# EAGLE design falownik_project (EAGLE 9.6.2)

## Sheet 1 of 5
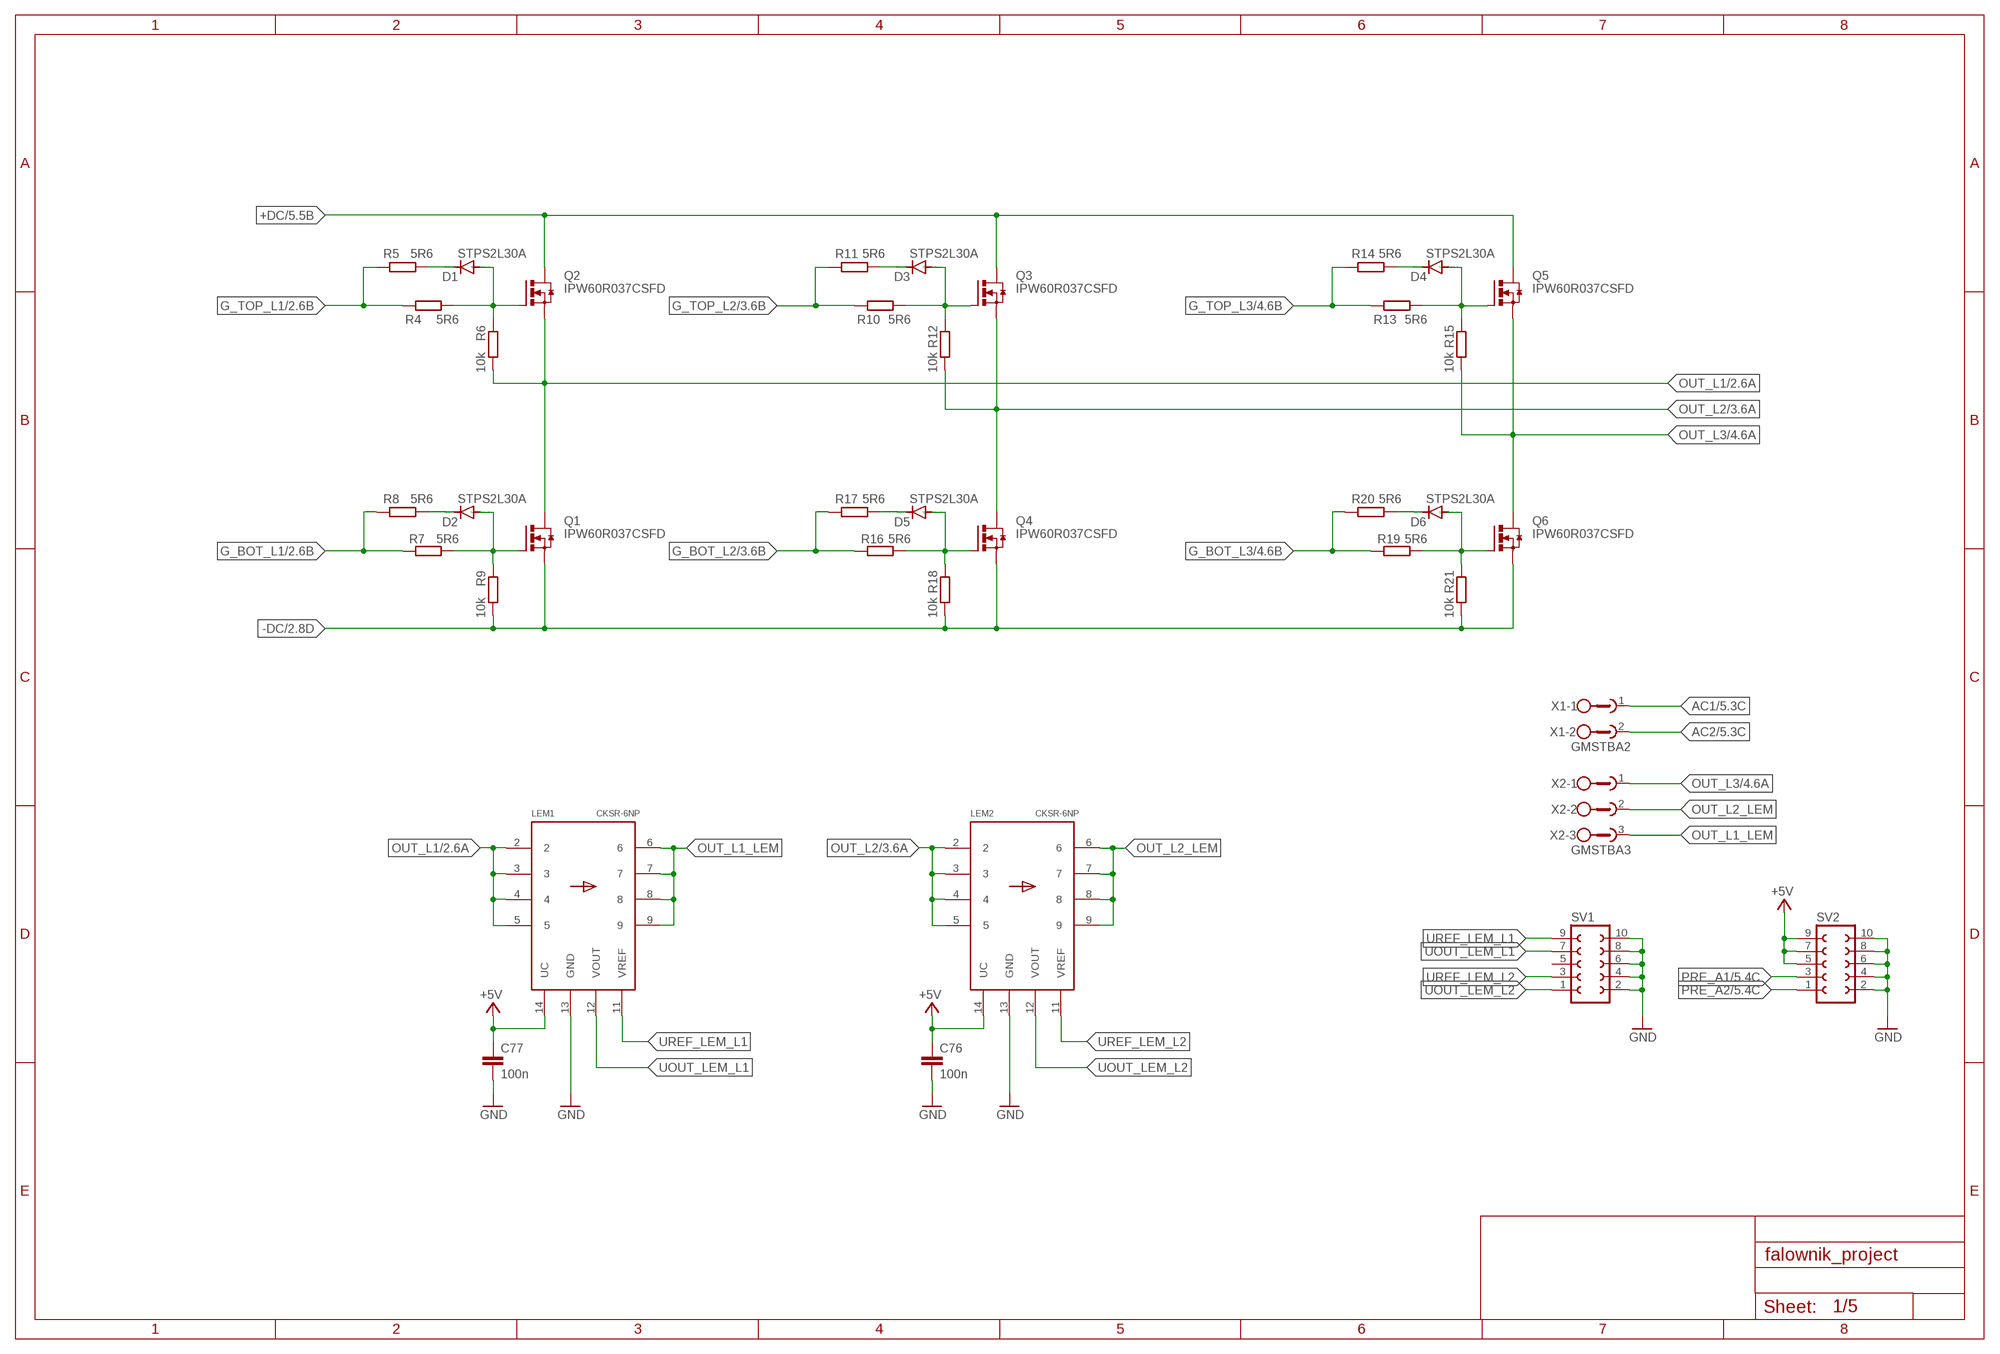
[diagram p0: schematic, sheet 1]

### Parts
C76  100n  C-EUC0805  [C0805]
C77  100n  C-EUC0805  [C0805]
D1  STPS2L30A  DIODE-DO214AC  [DO214AC]
D2  STPS2L30A  DIODE-DO214AC  [DO214AC]
D3  STPS2L30A  DIODE-DO214AC  [DO214AC]
D4  STPS2L30A  DIODE-DO214AC  [DO214AC]
D5  STPS2L30A  DIODE-DO214AC  [DO214AC]
D6  STPS2L30A  DIODE-DO214AC  [DO214AC]
LEM1  CKSR-6NP  [CKSR]
LEM2  CKSR-6NP  [CKSR]
Q1  IPW60R037CSFD  IRFP240  [TO247BV]
Q2  IPW60R037CSFD  IRFP240  [TO247BV]
Q3  IPW60R037CSFD  IRFP240  [TO247BV]
Q4  IPW60R037CSFD  IRFP240  [TO247BV]
Q5  IPW60R037CSFD  IRFP240  [TO247BV]
Q6  IPW60R037CSFD  IRFP240  [TO247BV]
R4  5R6  R-EU_R0603  [R0603]
R5  5R6  R-EU_R0603  [R0603]
R6  10k  R-EU_R0603  [R0603]
R7  5R6  R-EU_R0603  [R0603]
R8  5R6  R-EU_R0603  [R0603]
R9  10k  R-EU_R0603  [R0603]
R10  5R6  R-EU_R0603  [R0603]
R11  5R6  R-EU_R0603  [R0603]
R12  10k  R-EU_R0603  [R0603]
R13  5R6  R-EU_R0603  [R0603]
R14  5R6  R-EU_R0603  [R0603]
R15  10k  R-EU_R0603  [R0603]
R16  5R6  R-EU_R0603  [R0603]
R17  5R6  R-EU_R0603  [R0603]
R18  10k  R-EU_R0603  [R0603]
R19  5R6  R-EU_R0603  [R0603]
R20  5R6  R-EU_R0603  [R0603]
R21  10k  R-EU_R0603  [R0603]
SV1  FE05-2  [FE05-2]
SV2  FE05-2  [FE05-2]
X1  GMSTBA2  [GMSTBA2]
X2  GMSTBA3  [GMSTBA3]

### Nets
+5V: C76.1 C77.1 LEM1.14(UC) LEM2.14(UC) SV2.5 SV2.7 SV2.9 ; also sheet 2,3,4
+DC: Q2.D Q3.D Q5.D ; also sheet 5
-DC: Q1.S Q4.S Q6.S R9.2 R18.2 R21.2 ; also sheet 2,3,4,5
AC1: X1.1 ; also sheet 5
AC2: X1.2 ; also sheet 5
G_BOT_L1: R7.1 R8.1 ; also sheet 2
G_BOT_L2: R16.1 R17.1 ; also sheet 3
G_BOT_L3: R19.1 R20.1 ; also sheet 4
G_TOP_L1: R4.1 R5.1 ; also sheet 2
G_TOP_L2: R10.1 R11.1 ; also sheet 3
G_TOP_L3: R13.1 R14.1 ; also sheet 4
GND: C76.2 C77.2 LEM1.13(GND) LEM2.13(GND) SV1.2 SV1.4 SV1.6 SV1.8 SV1.10 SV2.2 SV2.4 SV2.6 SV2.8 SV2.10 ; also sheet 2,3,4
N$7: D1.A Q2.G R4.2 R6.1
N$8: D1.C R5.2
N$12: D2.A Q1.G R7.2 R9.1
N$13: D2.C R8.2
N$14: D3.A Q3.G R10.2 R12.1
N$15: D3.C R11.2
N$16: D4.A Q5.G R13.2 R15.1
N$17: D4.C R14.2
N$18: D5.A Q4.G R16.2 R18.1
N$19: D5.C R17.2
N$20: D6.A Q6.G R19.2 R21.1
N$21: D6.C R20.2
OUT_L1: LEM1.2 LEM1.3 LEM1.4 LEM1.5 Q1.D Q2.S R6.2 ; also sheet 2
OUT_L1_LEM: LEM1.6 LEM1.7 LEM1.8 LEM1.9 X2.3
OUT_L2: LEM2.2 LEM2.3 LEM2.4 LEM2.5 Q3.S Q4.D R12.2 ; also sheet 3
OUT_L2_LEM: LEM2.6 LEM2.7 LEM2.8 LEM2.9 X2.2
OUT_L3: Q5.S Q6.D R15.2 X2.1 ; also sheet 4
PRE_A1: SV2.3 ; also sheet 5
PRE_A2: SV2.1 ; also sheet 5
UOUT_LEM_L1: LEM1.12(VOUT) SV1.7
UOUT_LEM_L2: LEM2.12(VOUT) SV1.1
UREF_LEM_L1: LEM1.11(VREF) SV1.9
UREF_LEM_L2: LEM2.11(VREF) SV1.3
Unconnected: SV1.5

## Sheet 2 of 5
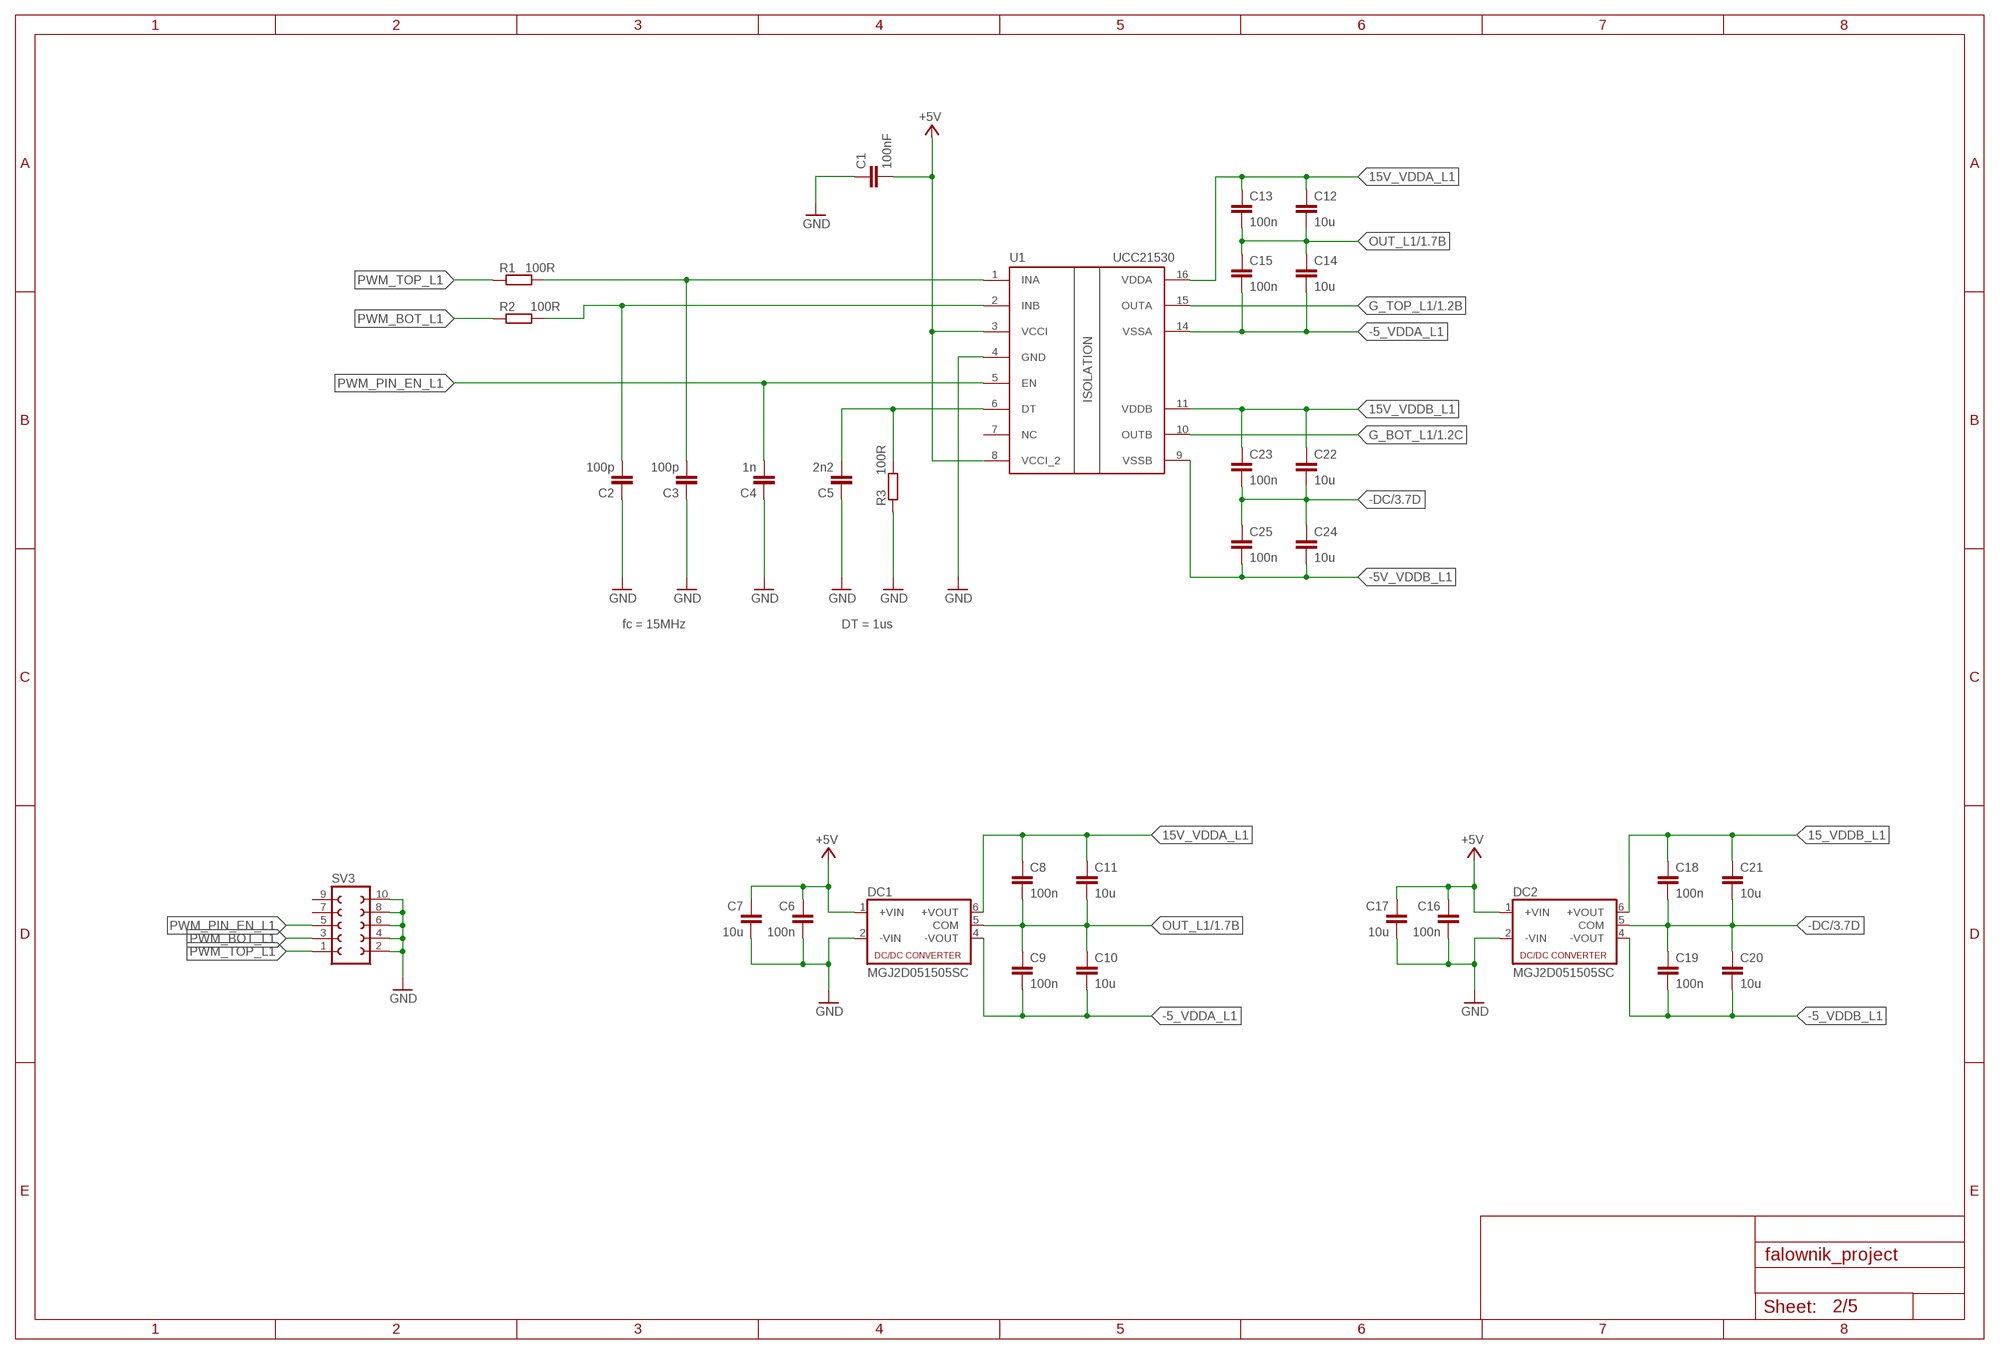
[diagram p1: schematic, sheet 2]

### Parts
C1  100nF  C-EUC0603  [C0603]
C2  100p  C-EUC0603  [C0603]
C3  100p  C-EUC0603  [C0603]
C4  1n  C-EUC0603  [C0603]
C5  2n2  C-EUC0603  [C0603]
C6  100n  C-EUC0603  [C0603]
C7  10u  C-EUC1206  [C1206]
C8  100n  C-EUC0603  [C0603]
C9  100n  C-EUC0603  [C0603]
C10  10u  C-EUC1206  [C1206]
C11  10u  C-EUC1210  [C1210]
C12  10u  C-EUC1210  [C1210]
C13  100n  C-EUC0603  [C0603]
C14  10u  C-EUC1206  [C1206]
C15  100n  C-EUC0603  [C0603]
C16  100n  C-EUC0603  [C0603]
C17  10u  C-EUC1206  [C1206]
C18  100n  C-EUC0603  [C0603]
C19  100n  C-EUC0603  [C0603]
C20  10u  C-EUC1206  [C1206]
C21  10u  C-EUC1210  [C1210]
C22  10u  C-EUC1210  [C1210]
C23  100n  C-EUC0603  [C0603]
C24  10u  C-EUC1206  [C1206]
C25  100n  C-EUC0603  [C0603]
DC1  MGJ2D051505SC  [MGJ2D051505SC]
DC2  MGJ2D051505SC  [MGJ2D051505SC]
R1  100R  R-EU_R0603  [R0603]
R2  100R  R-EU_R0603  [R0603]
R3  100R  R-EU_R0603  [R0603]
SV3  FE05-2  [FE05-2]
U1  UCC21530  [SOIC-14]

### Nets
15_VDDB_L1: C18.1 C21.1 DC2.6(+VOUT)
15V_VDDA_L1: C8.1 C11.1 DC1.6(+VOUT)
+5V: C1.2 C6.1 C7.1 C16.1 C17.1 DC1.1(+VIN) DC2.1(+VIN) U1.3(VCCI) U1.8(VCCI_2) ; also sheet 1,3,4
-5_VDDA_L1: C9.2 C10.2 DC1.4(-VOUT)
-5_VDDB_L1: C19.2 C20.2 DC2.4(-VOUT)
-DC: C18.2 C19.1 C20.1 C21.2 C22.2 C23.2 C24.1 C25.1 DC2.5(COM) ; also sheet 1,3,4,5
G_BOT_L1: U1.10(OUTB) ; also sheet 1
G_TOP_L1: U1.15(OUTA) ; also sheet 1
GND: C1.1 C2.1 C3.1 C4.1 C5.1 C6.2 C7.2 C16.2 C17.2 DC1.2(-VIN) DC2.2(-VIN) R3.1 SV3.2 SV3.4 SV3.6 SV3.8 SV3.10 U1.4(GND) ; also sheet 1,3,4
N$1: C3.2 R1.2 U1.1(INA)
N$2: C2.2 R2.2 U1.2(INB)
N$3: C5.2 R3.2 U1.6(DT)
N$4: C14.2 C15.2 U1.14(VSSA)
N$5: C12.1 C13.1 U1.16(VDDA)
N$9: C24.2 C25.2 U1.9(VSSB)
N$10: C22.1 C23.1 U1.11(VDDB)
OUT_L1: C8.2 C9.1 C10.1 C11.2 C12.2 C13.2 C14.1 C15.1 DC1.5(COM) ; also sheet 1
PWM_BOT_L1: R2.1 SV3.3
PWM_PIN_EN_L1: C4.2 SV3.5 U1.5(EN)
PWM_TOP_L1: R1.1 SV3.1
Unconnected: SV3.7 SV3.9 U1.7(NC)

### Notes on the sheet
- fc = 15MHz | DT = 1us

## Sheet 3 of 5
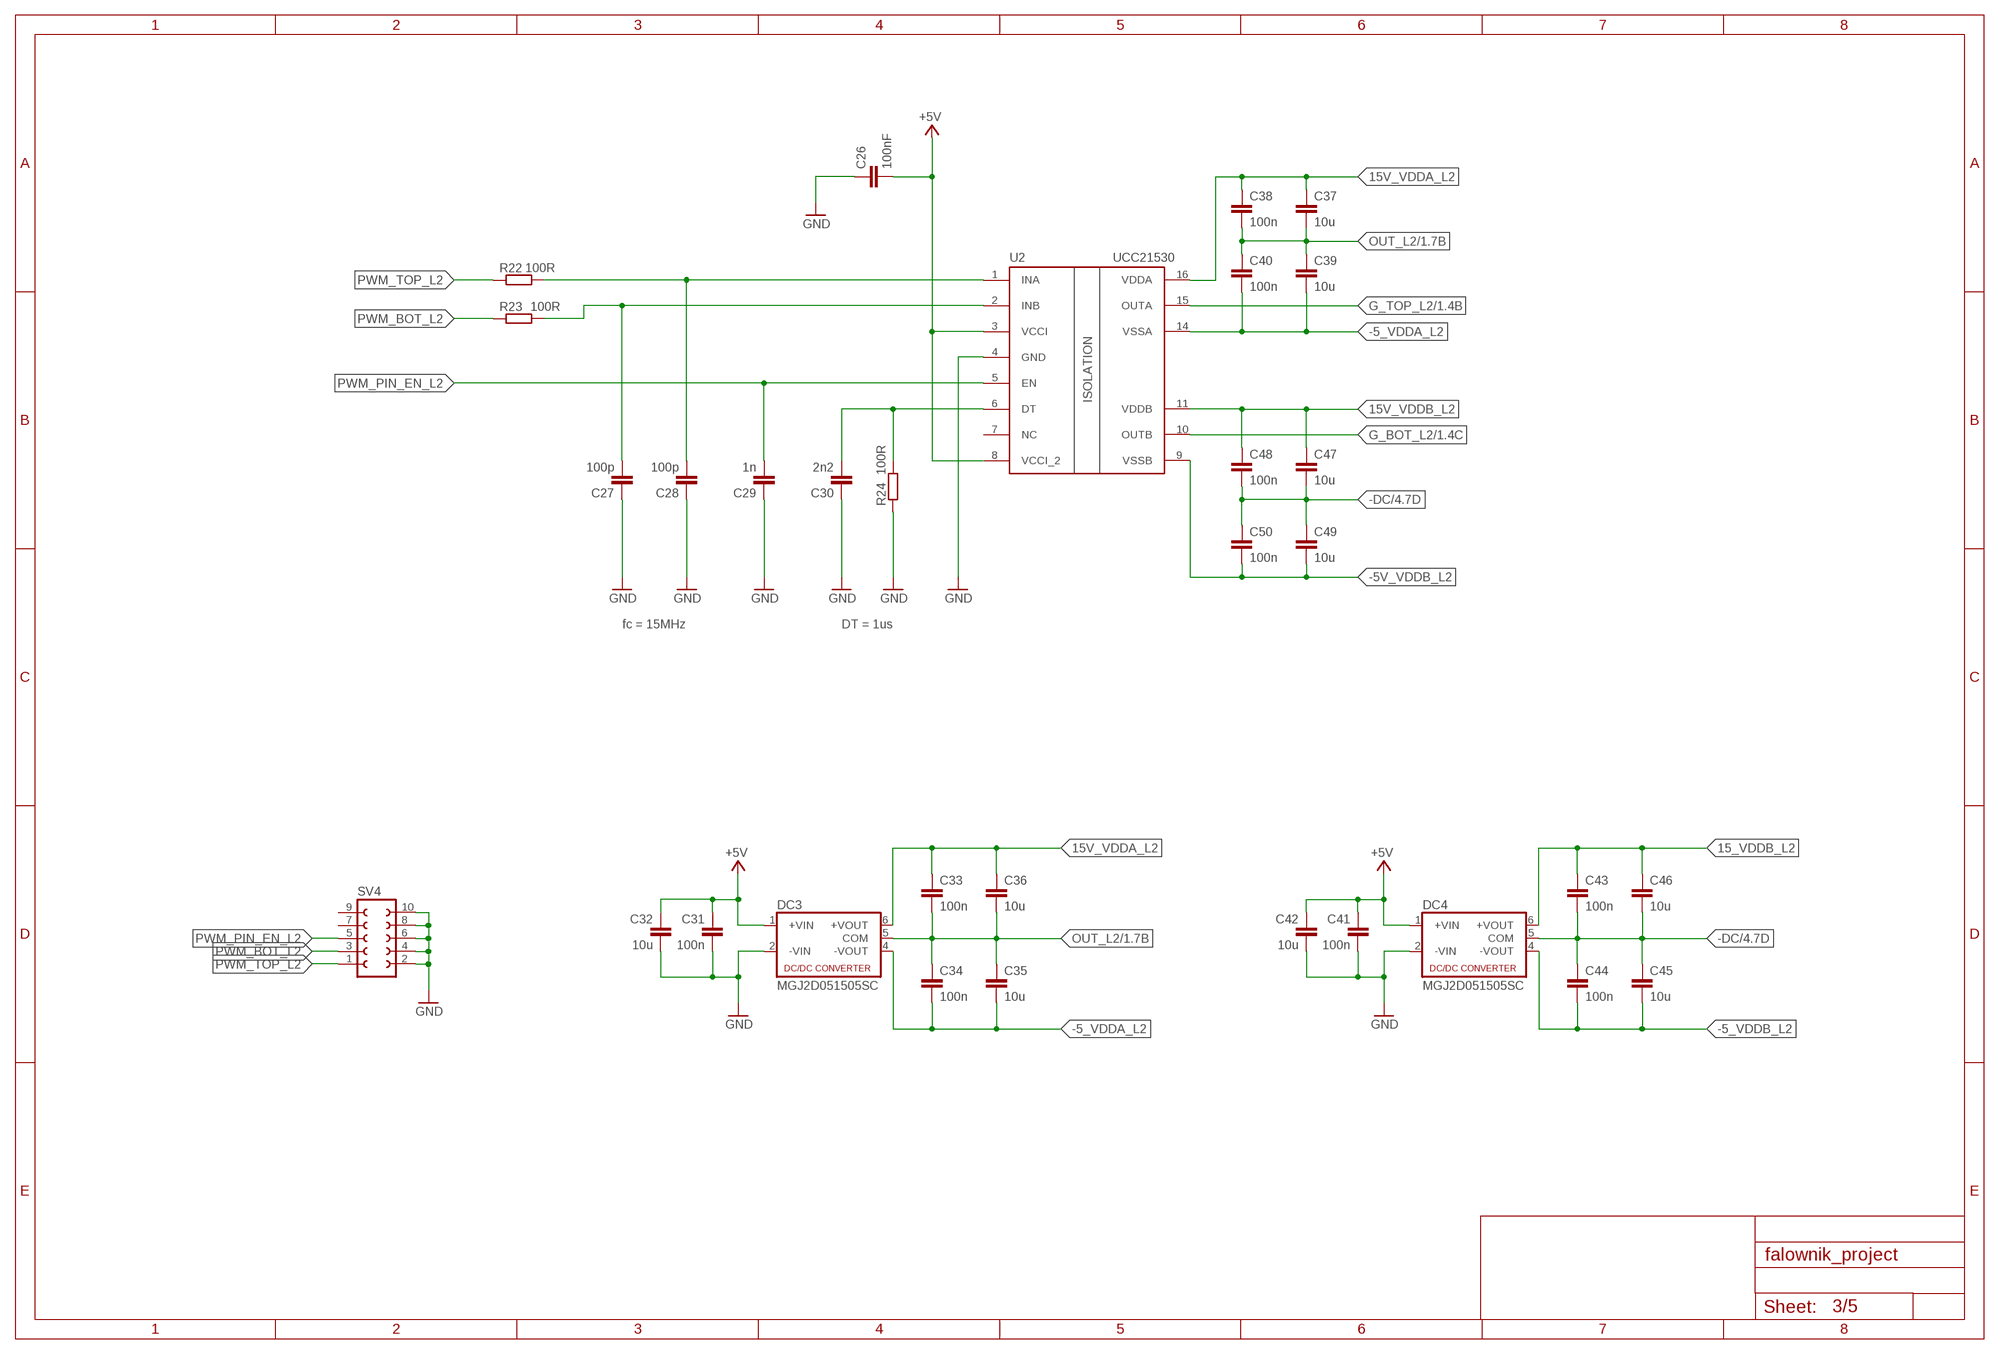
[diagram p2: schematic, sheet 3]

### Parts
C26  100nF  C-EUC0603  [C0603]
C27  100p  C-EUC0603  [C0603]
C28  100p  C-EUC0603  [C0603]
C29  1n  C-EUC0603  [C0603]
C30  2n2  C-EUC0603  [C0603]
C31  100n  C-EUC0603  [C0603]
C32  10u  C-EUC1206  [C1206]
C33  100n  C-EUC0603  [C0603]
C34  100n  C-EUC0603  [C0603]
C35  10u  C-EUC1206  [C1206]
C36  10u  C-EUC1210  [C1210]
C37  10u  C-EUC1210  [C1210]
C38  100n  C-EUC0603  [C0603]
C39  10u  C-EUC1206  [C1206]
C40  100n  C-EUC0603  [C0603]
C41  100n  C-EUC0603  [C0603]
C42  10u  C-EUC1206  [C1206]
C43  100n  C-EUC0603  [C0603]
C44  100n  C-EUC0603  [C0603]
C45  10u  C-EUC1206  [C1206]
C46  10u  C-EUC1210  [C1210]
C47  10u  C-EUC1210  [C1210]
C48  100n  C-EUC0603  [C0603]
C49  10u  C-EUC1206  [C1206]
C50  100n  C-EUC0603  [C0603]
DC3  MGJ2D051505SC  [MGJ2D051505SC]
DC4  MGJ2D051505SC  [MGJ2D051505SC]
R22  100R  R-EU_R0603  [R0603]
R23  100R  R-EU_R0603  [R0603]
R24  100R  R-EU_R0603  [R0603]
SV4  FE05-2  [FE05-2]
U2  UCC21530  [SOIC-14]

### Nets
15_VDDB_L2: C43.1 C46.1 DC4.6(+VOUT)
15V_VDDA_L2: C33.1 C36.1 DC3.6(+VOUT)
+5V: C26.2 C31.1 C32.1 C41.1 C42.1 DC3.1(+VIN) DC4.1(+VIN) U2.3(VCCI) U2.8(VCCI_2) ; also sheet 1,2,4
-5_VDDA_L2: C34.2 C35.2 DC3.4(-VOUT)
-5_VDDB_L2: C44.2 C45.2 DC4.4(-VOUT)
-DC: C43.2 C44.1 C45.1 C46.2 C47.2 C48.2 C49.1 C50.1 DC4.5(COM) ; also sheet 1,2,4,5
G_BOT_L2: U2.10(OUTB) ; also sheet 1
G_TOP_L2: U2.15(OUTA) ; also sheet 1
GND: C26.1 C27.1 C28.1 C29.1 C30.1 C31.2 C32.2 C41.2 C42.2 DC3.2(-VIN) DC4.2(-VIN) R24.1 SV4.2 SV4.4 SV4.6 SV4.8 SV4.10 U2.4(GND) ; also sheet 1,2,4
N$22: C28.2 R22.2 U2.1(INA)
N$23: C27.2 R23.2 U2.2(INB)
N$24: C30.2 R24.2 U2.6(DT)
N$25: C39.2 C40.2 U2.14(VSSA)
N$26: C37.1 C38.1 U2.16(VDDA)
N$28: C49.2 C50.2 U2.9(VSSB)
N$29: C47.1 C48.1 U2.11(VDDB)
OUT_L2: C33.2 C34.1 C35.1 C36.2 C37.2 C38.2 C39.1 C40.1 DC3.5(COM) ; also sheet 1
PWM_BOT_L2: R23.1 SV4.3
PWM_PIN_EN_L2: C29.2 SV4.5 U2.5(EN)
PWM_TOP_L2: R22.1 SV4.1
Unconnected: SV4.7 SV4.9 U2.7(NC)

### Notes on the sheet
- fc = 15MHz | DT = 1us

## Sheet 4 of 5
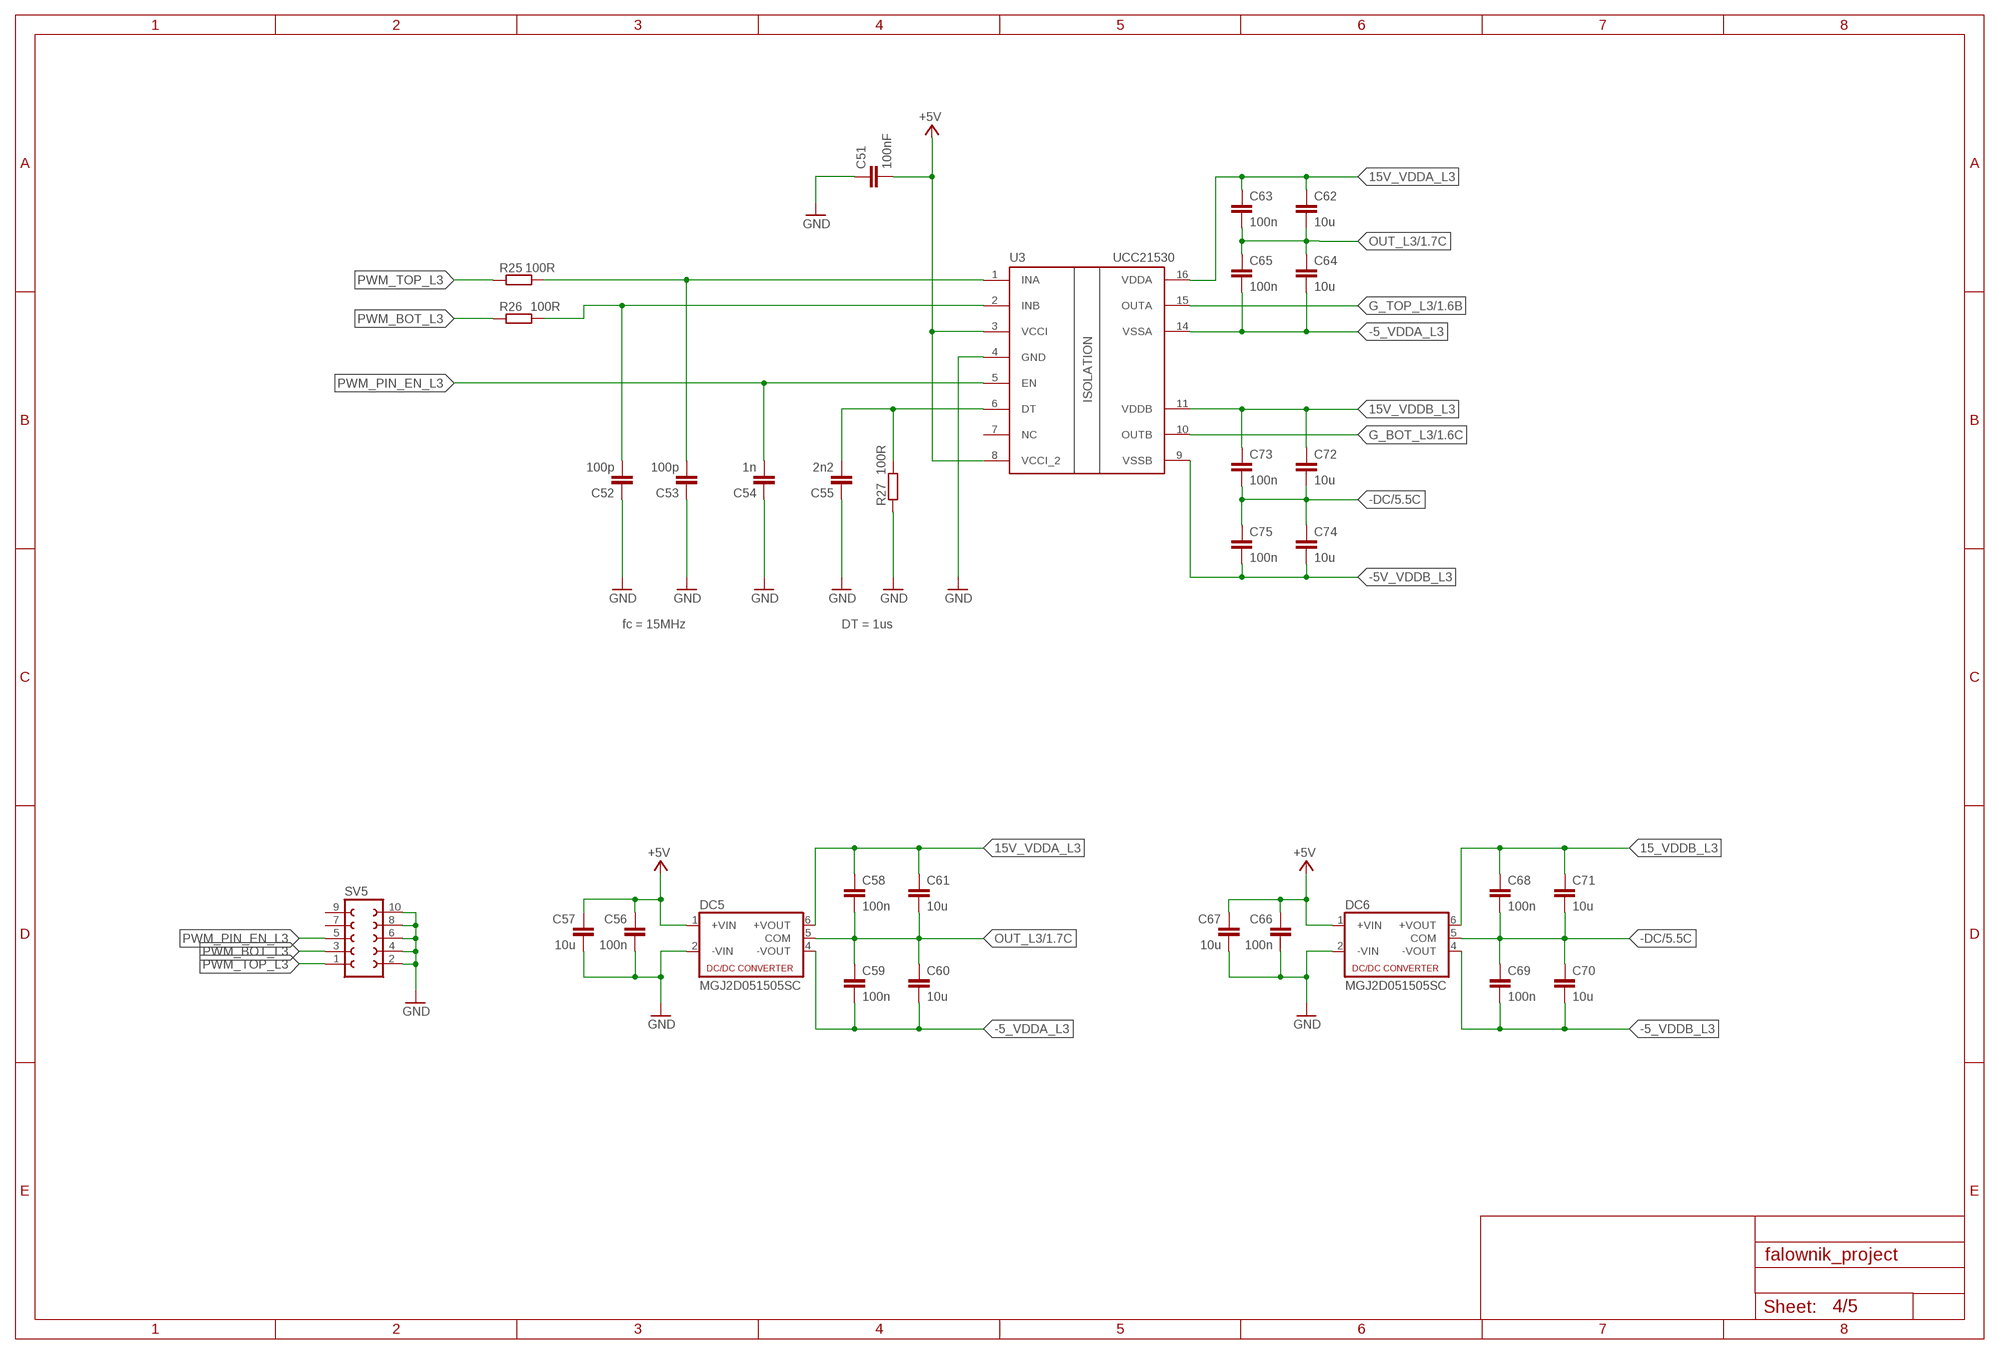
[diagram p3: schematic, sheet 4]

### Parts
C51  100nF  C-EUC0603  [C0603]
C52  100p  C-EUC0603  [C0603]
C53  100p  C-EUC0603  [C0603]
C54  1n  C-EUC0603  [C0603]
C55  2n2  C-EUC0603  [C0603]
C56  100n  C-EUC0603  [C0603]
C57  10u  C-EUC1206  [C1206]
C58  100n  C-EUC0603  [C0603]
C59  100n  C-EUC0603  [C0603]
C60  10u  C-EUC1206  [C1206]
C61  10u  C-EUC1210  [C1210]
C62  10u  C-EUC1210  [C1210]
C63  100n  C-EUC0603  [C0603]
C64  10u  C-EUC1206  [C1206]
C65  100n  C-EUC0603  [C0603]
C66  100n  C-EUC0603  [C0603]
C67  10u  C-EUC1206  [C1206]
C68  100n  C-EUC0603  [C0603]
C69  100n  C-EUC0603  [C0603]
C70  10u  C-EUC1206  [C1206]
C71  10u  C-EUC1210  [C1210]
C72  10u  C-EUC1210  [C1210]
C73  100n  C-EUC0603  [C0603]
C74  10u  C-EUC1206  [C1206]
C75  100n  C-EUC0603  [C0603]
DC5  MGJ2D051505SC  [MGJ2D051505SC]
DC6  MGJ2D051505SC  [MGJ2D051505SC]
R25  100R  R-EU_R0603  [R0603]
R26  100R  R-EU_R0603  [R0603]
R27  100R  R-EU_R0603  [R0603]
SV5  FE05-2  [FE05-2]
U3  UCC21530  [SOIC-14]

### Nets
15_VDDB_L3: C68.1 C71.1 DC6.6(+VOUT)
15V_VDDA_L3: C58.1 C61.1 DC5.6(+VOUT)
+5V: C51.2 C56.1 C57.1 C66.1 C67.1 DC5.1(+VIN) DC6.1(+VIN) U3.3(VCCI) U3.8(VCCI_2) ; also sheet 1,2,3
-5_VDDA_L3: C59.2 C60.2 DC5.4(-VOUT)
-5_VDDB_L3: C69.2 C70.2 DC6.4(-VOUT)
-DC: C68.2 C69.1 C70.1 C71.2 C72.2 C73.2 C74.1 C75.1 DC6.5(COM) ; also sheet 1,2,3,5
G_BOT_L3: U3.10(OUTB) ; also sheet 1
G_TOP_L3: U3.15(OUTA) ; also sheet 1
GND: C51.1 C52.1 C53.1 C54.1 C55.1 C56.2 C57.2 C66.2 C67.2 DC5.2(-VIN) DC6.2(-VIN) R27.1 SV5.2 SV5.4 SV5.6 SV5.8 SV5.10 U3.4(GND) ; also sheet 1,2,3
N$31: C53.2 R25.2 U3.1(INA)
N$32: C52.2 R26.2 U3.2(INB)
N$33: C55.2 R27.2 U3.6(DT)
N$34: C64.2 C65.2 U3.14(VSSA)
N$35: C62.1 C63.1 U3.16(VDDA)
N$37: C74.2 C75.2 U3.9(VSSB)
N$38: C72.1 C73.1 U3.11(VDDB)
OUT_L3: C58.2 C59.1 C60.1 C61.2 C62.2 C63.2 C64.1 C65.1 DC5.5(COM) ; also sheet 1
PWM_BOT_L3: R26.1 SV5.3
PWM_PIN_EN_L3: C54.2 SV5.5 U3.5(EN)
PWM_TOP_L3: R25.1 SV5.1
Unconnected: SV5.7 SV5.9 U3.7(NC)

### Notes on the sheet
- fc = 15MHz | DT = 1us

## Sheet 5 of 5
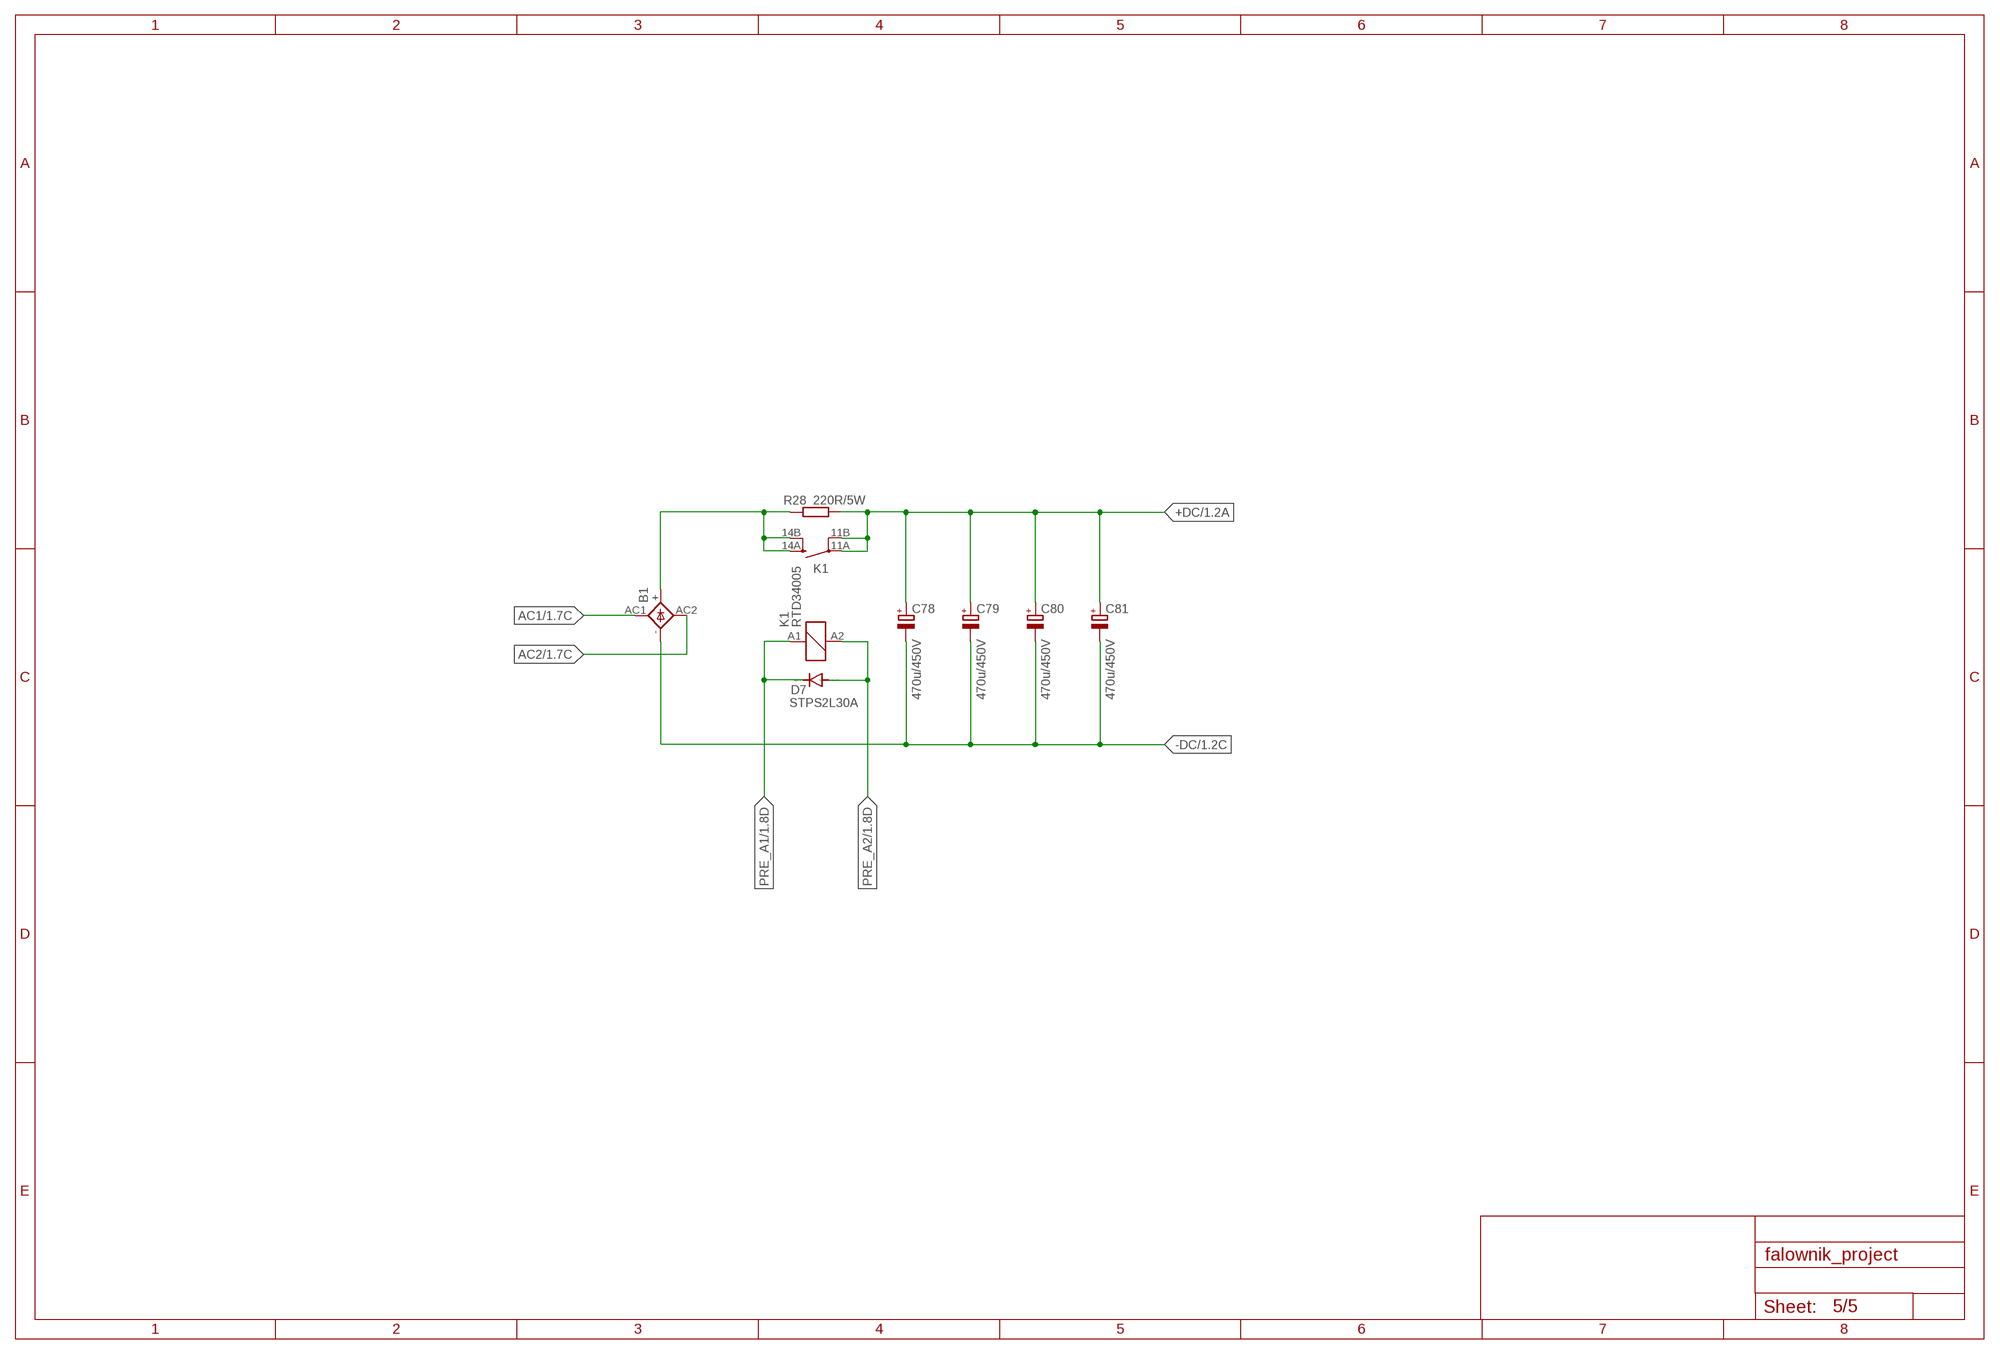
[diagram p4: schematic, sheet 5]

### Parts
B1  GBPC80X  [GBPC80X]
C78  470u/450V  CPOL-EUE10-30  [EB30D]
C79  470u/450V  CPOL-EUE10-30  [EB30D]
C80  470u/450V  CPOL-EUE10-30  [EB30D]
C81  470u/450V  CPOL-EUE10-30  [EB30D]
D7  STPS2L30A  DIODE-DO214AC  [DO214AC]
K1  RTD34005  [RT-N/O16A5]
R28  220R/5W  R-EU_VTA52  [VTA52]

### Nets
+DC: C78.+ C79.+ C80.+ C81.+ K1.11A(2:PA) K1.11B(2:PB) R28.2 ; also sheet 1
-DC: B1.- C78.- C79.- C80.- C81.- ; also sheet 1,2,3,4
AC1: B1.AC1 ; also sheet 1
AC2: B1.AC2 ; also sheet 1
N$27: B1.+ K1.14A(2:SA) K1.14B(2:SB) R28.1
PRE_A1: D7.C K1.A1 ; also sheet 1
PRE_A2: D7.A K1.A2 ; also sheet 1

## Library data of the parts
B1 = rectifier:GBPC80X: GENERAL INSTRUMENT RECTIFIER
C1-C77 = rcl:C-EU: CAPACITOR, European symbol; SPICEPREFIX: C
C78-C81 = rcl:CPOL-EU: POLARIZED CAPACITOR, European symbol; SPICEPREFIX: C
D1-D7 = diode:DIODE-: DIODE
DC1-DC6 = MGJ2:MGJ2D051505SC
K1 = relay:RTD3*: Power PCB Relay SCHRACK 1 pole 12 / 16 A, DC- or AC-coil Source: http://www.schrack.com/.. 5819.pdf; MF: TYCO ELECTRONICS; MPN: RTD34005; OC_FARNELL: unknown; OC_NEWARK: 93B4654
LEM1 LEM2 = CKSR_lib:CKSR-6NP
Q1-Q6 = transistor-power:IRFP240: HEXFET Power MosFet Source: http://www.irf.com/
R1-R28 = rcl:R-EU_: RESISTOR, European symbol; SPICEPREFIX: R
SV1-SV5 = con-lsta:FE05-2: FEMALE HEADER; OC_FARNELL: unknown; OC_NEWARK: unknown
U1-U3 = SOIC-14:UCC21530
X1 = con-phoenix-762:GMSTBA2: PHOENIX; MF: FARNELL; MPN: 1757242; OC_FARNELL: 3705171; OC_NEWARK: 71C4161
X2 = con-phoenix-762:GMSTBA3: PHOENIX; MF: FARNELL; MPN: 1757255; OC_FARNELL: 3705183; OC_NEWARK: 71C4162

## Board
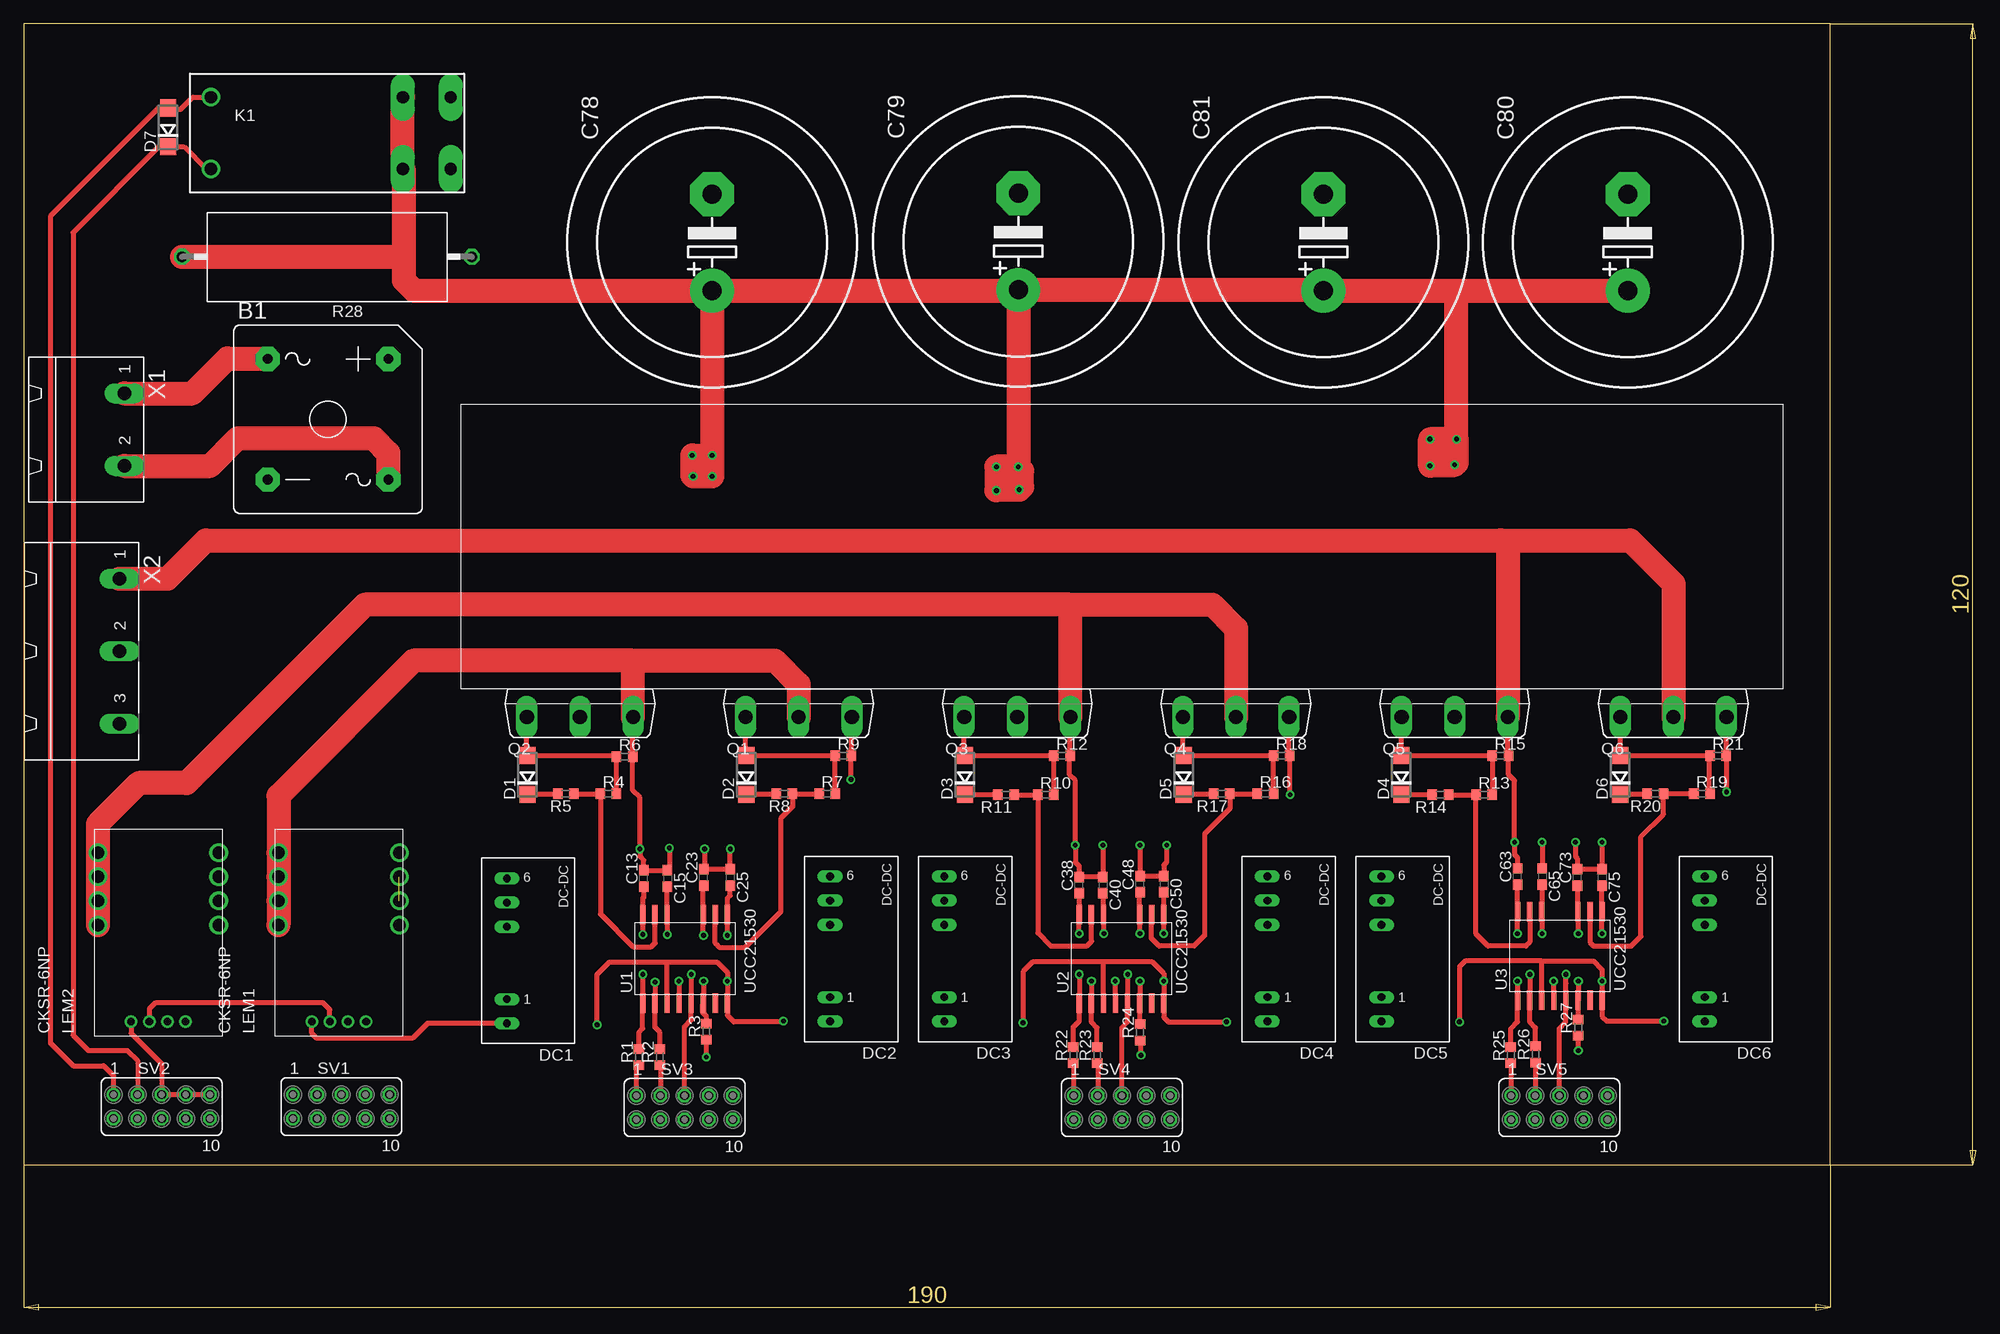
[diagram p5: board, top side]
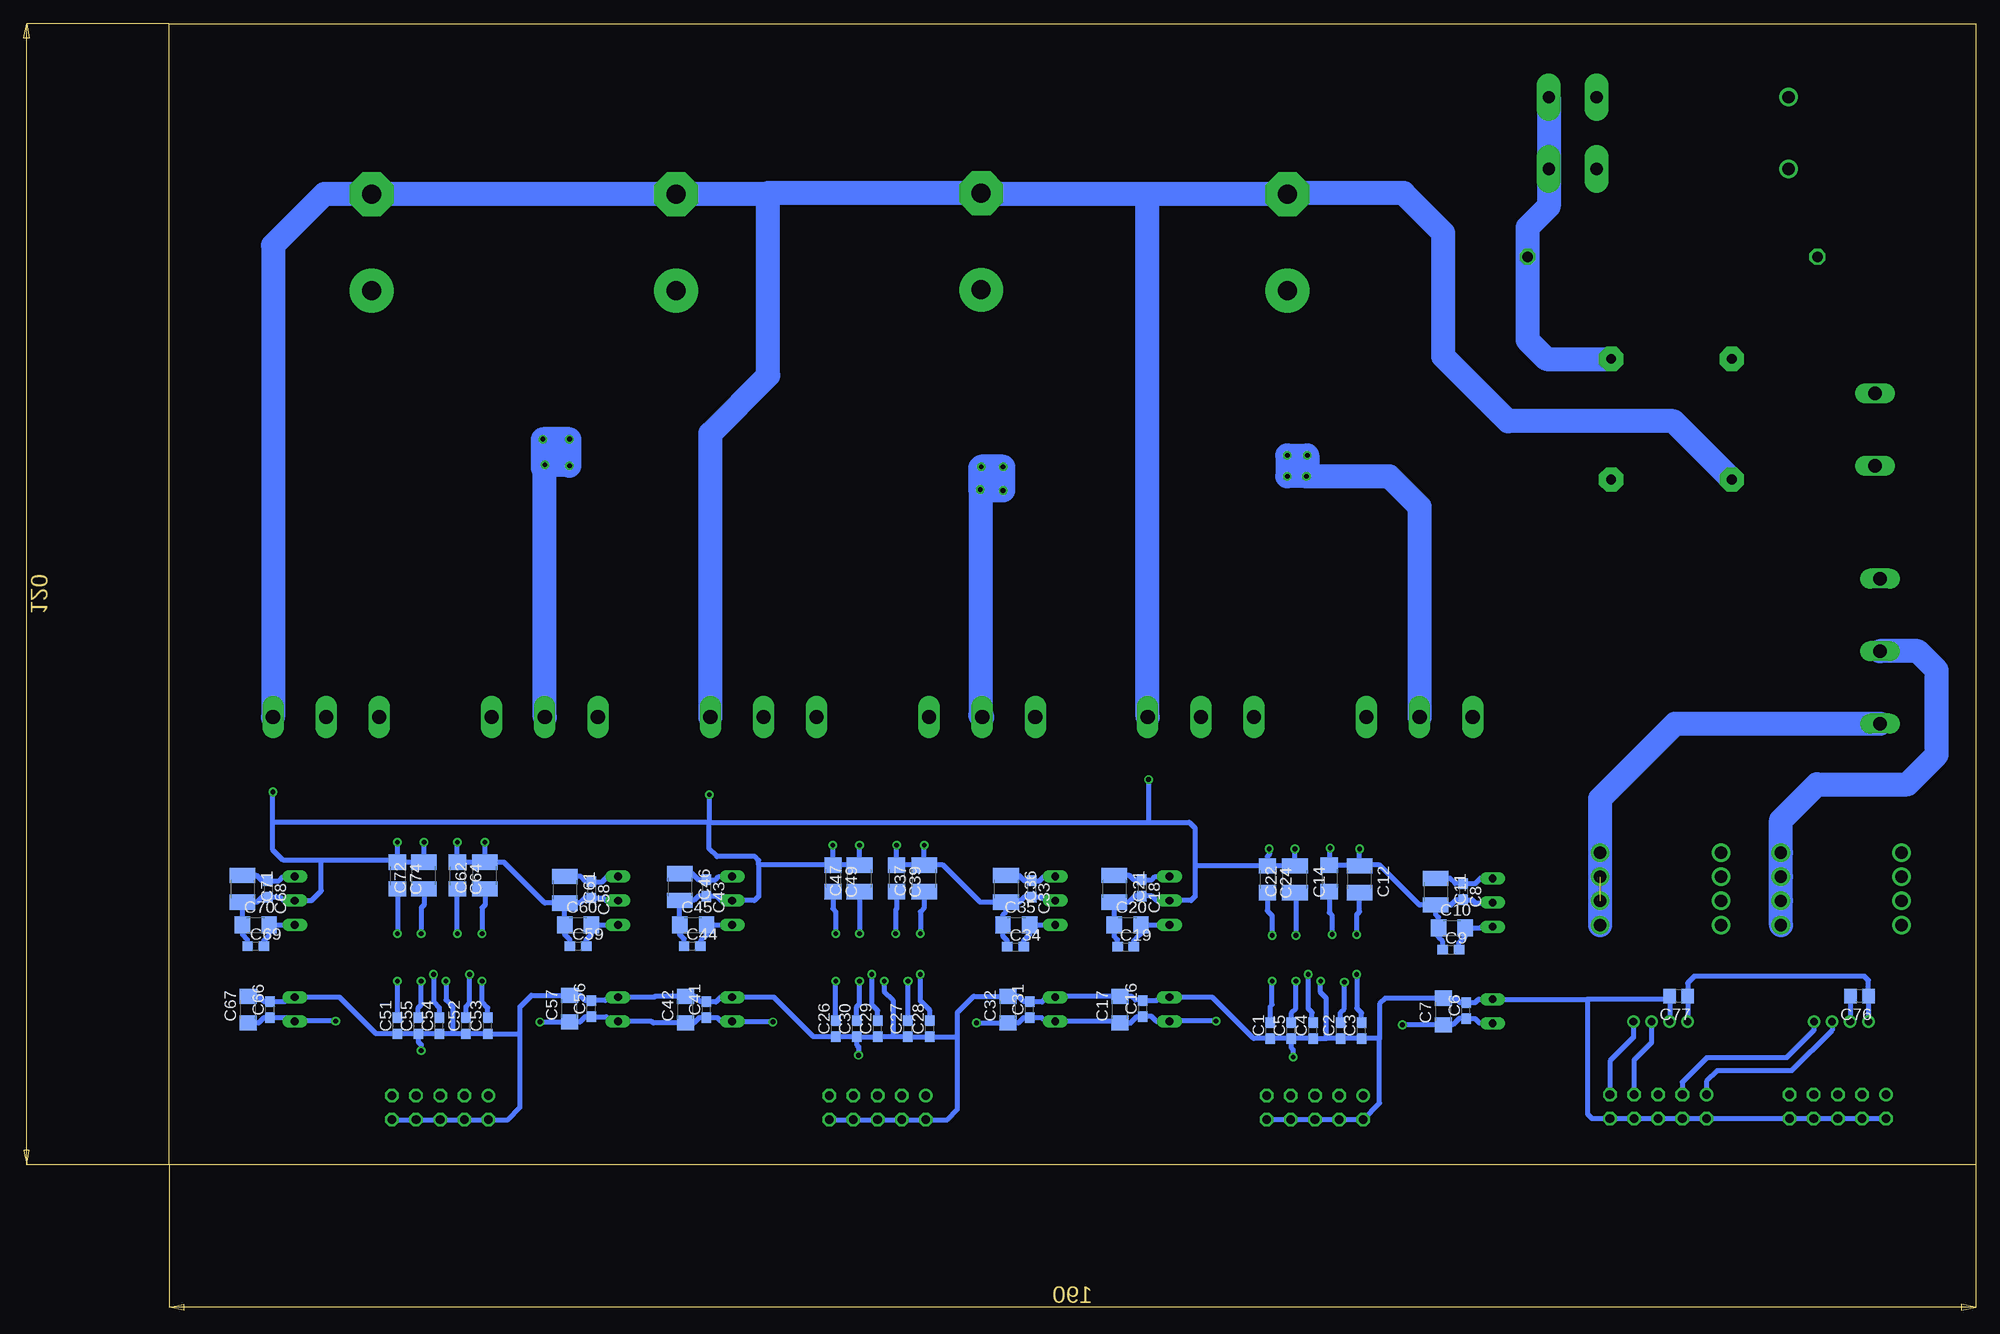
[diagram p6: board, bottom side, seen from below]

Size 190 x 120 mm. Coordinates in mm from the lower left corner, seen from the top.
Outline: 0,0 190,0 190,120 0,120 0,0
Copper layers (1*16): Top 0.035mm / dielectric 1.5mm / Bottom 0.035mm
Design rules "default *": minimum track width 0.5mm, minimum drill 0.5mm, track to track 0.5mm, track to pad 0.5mm, pad to pad 0.5mm, via to via 0.5mm, smd to smd 0.5mm, copper to edge 1mm, drill to drill 6mil, minimum pad ring 10mil, minimum via ring 8mil, stop-mask expansion 4mil, vias tented up to drill 0mil, thermal gap 10mil

### Footprints (pad centres in the part's own frame; a part is rotated, then mirrored left to right if it is on the bottom)
GBPC80X = drill 1.016 pad 2.54 octagon: + 6.35,6.35; - -6.35,-6.35; AC1 -6.35,6.35; AC2 6.35,-6.35
C0603 = smd 1.1 x 1: 1 -0.85,0; 2 0.85,0
C1206 = smd 1.6 x 1.8: 1 -1.4,0; 2 1.4,0
C1210 = smd 1.6 x 2.7: 1 -1.4,0; 2 1.4,0
C0805 = smd 1.3 x 1.5: 1 -0.95,0; 2 0.95,0
EB30D = drill 2.007 pad 4.597: + -5.08,0 | drill 2.007 pad 4.597 octagon: - 5.08,0
DO214AC = smd 1.8 x 1.7: A 2.05,0; C -2.05,0
MGJ2D051505SC = drill 0.813 long: 1 0,15.24; 2 0,12.7; 4 0,5.08; 5 0,2.54; 6 0,0
RT-N/O16A5 = drill 1.3 pad 2.5 long: 11A 7.56,3.78; 11B 7.56,-3.78; 14A 12.6,3.78; 14B 12.6,-3.78 | drill 1.3: A1 -12.6,-3.78; A2 -12.6,3.78
CKSR = drill 1.3: 2 0,12.7; 3 2.54,12.7; 4 5.08,12.7; 5 7.62,12.7; 6 7.62,0; 7 5.08,0; 8 2.54,0; 9 0,0 | drill 0.8: 11 -10.17,3.493; 12 -10.17,5.397; 13 -10.17,7.303; 14 -10.17,9.207
TO247BV = drill 1.499 long: D 0,-2.921; G -5.588,-2.921; S 5.588,-2.921
R0603 = smd 1 x 1.1: 1 -0.85,0; 2 0.85,0
VTA52 = drill 1.1 octagon: 1 -15.24,0; 2 15.24,0
FE05-2 = drill 0.914: 1 -5.08,1.27 | drill 0.914 octagon: 2 -5.08,-1.27; 3 -2.54,1.27; 4 -2.54,-1.27; 5 0,1.27; 6 0,-1.27; 7 2.54,1.27; 8 2.54,-1.27; 9 5.08,1.27; 10 5.08,-1.27
SOIC-14 = smd 2 x 0.6: 1 0,8.89; 2 0,7.62; 3 0,6.35; 4 0,5.08; 5 0,3.81; 6 0,2.54; 7 0,1.27; 8 0,0; 9 9.3,0; 10 9.3,1.27; 11 9.3,2.54; 14 9.3,6.35; 15 9.3,7.62; 16 9.3,8.89
GMSTBA2 = drill 1.397 long: 1 -3.81,5.08; 2 3.81,5.08
GMSTBA3 = drill 1.397 long: 1 -7.62,5.08; 2 0,5.08; 3 7.62,5.08

### Placement (x,y rotation side)
B1  32,78.4 0 top
C1  74.2,14.1 90 bottom
C2  66.8,14.1 90 bottom
C3  64.6,14.1 90 bottom
C4  69.7,14.1 90 bottom
C5  72,14.1 90 bottom
C6  53.6,16.2 90 bottom
C7  56,16.1 90 bottom
C8  53.9,28.7 270 bottom
C9  55.2,22.6 0 bottom
C10  55.1,24.9 0 bottom
C11  56.8,28.7 270 bottom
C12  64.8,30 90 bottom
C13  65.2,30.1 90 top
C14  68,30.1 270 bottom
C15  67.7,30.1 270 top
C16  87.6,16.4 90 bottom
C17  90,16.3 90 bottom
C18  87.7,29.1 270 bottom
C19  89.4,22.9 0 bottom
C20  89.2,25.2 0 bottom
C21  90.6,29 270 bottom
C22  71.6,30 90 bottom
C23  71.5,30.2 90 top
C24  74.5,30 270 bottom
C25  74.3,30.2 270 top
C26  119.9,14.3 90 bottom
C27  112.3,14.3 90 bottom
C28  110,14.3 90 bottom
C29  115.5,14.3 90 bottom
C30  117.7,14.3 90 bottom
C31  99.5,16.3 90 bottom
C32  101.8,16.3 90 bottom
C33  99.3,29 270 bottom
C34  101,22.9 0 bottom
C35  100.9,25.2 0 bottom
C36  102,29 270 bottom
C37  110.6,30.1 90 bottom
C38  111,29.4 90 top
C39  113.5,30.1 270 bottom
C40  113.5,29.4 270 top
C41  133.5,16.3 90 bottom
C42  135.7,16.3 90 bottom
C43  133.5,29.1 270 bottom
C44  135,23 0 bottom
C45  134.9,25.2 0 bottom
C46  136.3,29.2 270 bottom
C47  117.4,30.1 90 bottom
C48  117.4,29.5 90 top
C49  120.2,30.1 270 bottom
C50  119.9,29.5 270 top
C51  166,14.6 90 bottom
C52  158.8,14.6 90 bottom
C53  156.5,14.6 90 bottom
C54  161.6,14.6 90 bottom
C55  163.8,14.6 90 bottom
C56  145.6,16.4 90 bottom
C57  147.9,16.4 90 bottom
C58  145.6,28.9 270 bottom
C59  147,23 0 bottom
C60  147,25.2 0 bottom
C61  148.4,28.9 270 bottom
C62  156.8,30.4 90 bottom
C63  157.1,30.3 90 top
C64  159.7,30.4 270 bottom
C65  159.7,30.3 270 top
C66  179.4,16.3 90 bottom
C67  181.7,16.3 90 bottom
C68  179.6,29 270 bottom
C69  180.9,23 0 bottom
C70  180.9,25.2 0 bottom
C71  182.3,29 270 bottom
C72  163.2,30.4 90 bottom
C73  163.4,30.2 90 top
C74  166,30.4 270 bottom
C75  166,30.2 270 top
C76  12.23,17.73 180 bottom
C77  31.24,17.73 180 bottom
C78  72.4,97 90 top
C79  104.6,97.1 90 top
C80  168.7,97 90 top
C81  136.7,97 90 top
D1  53,41 90 top
D2  76,41 90 top
D3  99,41 90 top
D4  144.9,41 90 top
D5  122,41 90 top
D6  167.9,41 90 top
D7  15.2,109.1 90 top
DC1  50.8,30.1 180 top
DC2  84.8,30.3 180 top
DC3  96.8,30.3 180 top
DC4  130.8,30.3 180 top
DC5  142.8,30.3 180 top
DC6  176.8,30.3 180 top
K1  32.3,108.5 0 top
LEM1  39.5,25.2 90 top
LEM2  20.5,25.2 90 top
Q1  81.5,50 0 top
Q2  58.5,50 0 top
Q3  104.5,50 0 top
Q4  127.5,50 0 top
Q5  150.5,50 0 top
Q6  173.5,50 0 top
R1  64.7,11.3 90 top
R2  66.9,11.3 90 top
R3  71.8,14 90 top
R4  61.5,39 0 top
R5  57,39 180 top
R6  63.2,42.9 0 top
R7  84.5,39 0 top
R8  80,39 180 top
R9  86.2,43 0 top
R10  107.5,38.9 0 top
R11  103.3,38.9 180 top
R12  109.2,43 0 top
R13  153.6,38.9 0 top
R14  149,38.9 180 top
R15  155.3,43 0 top
R16  130.6,39 0 top
R17  126,39 180 top
R18  132.3,43 0 top
R19  176.5,39 0 top
R20  171.6,39 180 top
R21  178.2,43 0 top
R22  110.4,11.5 90 top
R23  112.9,11.5 90 top
R24  117.4,13.9 90 top
R25  156.4,11.5 90 top
R26  159,11.6 90 top
R27  163.5,14.4 90 top
R28  31.9,95.5 180 top
SV1  33.4,6.1 0 top
SV2  14.5,6.1 0 top
SV3  69.5,6 0 top
SV4  115.5,6 0 top
SV5  161.5,6 0 top
U1  74,17 90 top
U2  119.9,17 90 top
U3  166,17.3 90 top
X1  5.5,77.3 270 top
X2  5,54 270 top

### Tracks (layer width: path | path; a pad name or v marks a point on that pad's centre or on a via)
15_VDDB_L1
  Bottom 0.5: DC2.6 86.3,30.3 86.65,29.95 C18.1 88.55,29.95 89,30.4 C21.1
15_VDDB_L2
  Bottom 0.5: DC4.6 132.2,30.3 132.55,29.95 C43.1 134.35,29.95 135,30.6 C46.1
15_VDDB_L3
  Bottom 0.5: DC6.6 178,30.3 178.45,29.85 C68.1 180.25,29.85 180.8,30.4 C71.1
15V_VDDA_L1
  Bottom 0.5: DC1.6 52.1,30.1 52.65,29.55 C8.1 54.75,29.55 55.3,30.1 C11.1
15V_VDDA_L2
  Bottom 0.5: DC3.6 98,30.3 98.45,29.85 C33.1 100.05,29.85 100.6,30.4 C36.1
15V_VDDA_L3
  Bottom 0.5: DC5.6 143.9,30.3 144.45,29.75 C58.1 145.65,29.8 146.2,29.8 146.7,30.3 C61.1
+5V  (via drill 0.5)
  Top 0.5: v79.9,15.1 79.8,15 74.7,15 74,15.7 U1.8 v74,19.3 74,20.2 72.9,21.3 67.7,21.3 | v60.3,14.7 60.3,20 61.6,21.3 67.7,21.3 | U2.3 113.55,21.3 | 113.55,21.3 106.1,21.3 105.1,20.3 v105.1,14.9 | v126.5,15 120.4,15 119.9,15.5 U2.8 v119.9,19.3 119.9,20.1 118.7,21.3 113.55,21.3 | U3.3 159.65,21.4 | 159.65,21.4 165.1,21.4 166,20.5 v166,19.3 U3.8 166,15.6 166.5,15.1 v172.5,15.1 | v151,15 151,20.8 151.6,21.4 159.65,21.4 | U1.3 67.65,21.25 67.7,21.3 | SV2.9 SV2.7 SV2.5 14.5,10.6 11.29,13.81 LEM2.14 | DC1.1 42.46,14.86 40.9,13.3 30.8,13.3 30.29,13.81 LEM1.14
  Bottom 0.5: DC1.1 52.16,14.86 52.65,15.35 C6.1 53.65,15.4 54.3,15.4 55,14.7 C7.1 v60.3,14.7 | C1.2 74.2,16.6 74,16.8 v74,19.3 | C26.2 v119.9,19.3 | v105.1,14.9 C32.1 100.7,14.9 100.15,15.45 C31.1 98.25,15.45 97.86,15.06 DC3.1 90.16,15.06 C17.1 88.9,14.9 88.25,15.55 C16.1 87.55,15.6 86.7,15.6 86.16,15.06 DC2.1 84.76,15.1 v79.9,15.1 | v126.5,15 130.74,15 DC4.1 131.96,15.06 132.35,15.45 C41.1 134.25,15.45 134.8,14.9 C42.1 139.1,14.9 139.26,15.06 DC5.1 143.56,15.06 144.05,15.55 C56.1 146.25,15.55 146.8,15 C57.1 v151,15 | C67.1 180.6,14.9 180.05,15.45 C66.1 177.55,15.45 177.16,15.06 DC6.1 176.76,15.1 v172.5,15.1 | C51.2 v166,19.3 | LEM2.14 11.29,17.72 C76.1 11.28,19.38 11.7,19.8 29.6,19.8 30.29,19.11 C77.1 LEM1.14
+DC  (via drill 0.5)
  Top 2.5: C78.+ 104.92,91.92 105,92 104.98,92.02 C79.+ | C79.+ 136.6,92.02 C81.+ 151,91.92 | 151,91.92 C80.+ | C78.+ v72.4,74.6 | v72.4,72.4 72.4,72.6 72,73 72,74.2 v72.4,74.6 | v72.4,74.6 v70.3,74.6 70.3,72.5 v70.4,72.4 v72.4,72.4 | v72.4,74.6 v72.4,72.4 | C79.+ v104.6,73.4 | v102.3,70.9 v102.3,73.4 v104.6,73.4 | v104.6,73.4 105,73 105,71.3 v104.7,71 102.4,71 v102.3,70.9 | v104.6,73.4 104.6,73.2 v102.3,70.9 | v150.5,73.6 148,73.6 v147.9,73.5 v147.9,76.3 | v150.7,76.3 v147.9,76.3 | v150.7,76.3 150.7,73.8 v150.5,73.6 | v147.9,76.3 150.5,73.7 v150.5,73.6 | v150.7,76.3 150.7,91.62 151,91.92 | 40,95 40,93 41.08,91.92 C78.+ | R28.2 39.5,95.5 40,95 | 40,95 40,104.58 K1.11B K1.11A
  Bottom 2.5: v70.4,72.4 v72.4,72.4 v72.4,74.6 v70.3,74.6 70.3,72.5 v70.4,72.4 | v70.4,72.4 61.7,72.4 58.5,69.2 Q2.D | v104.7,71 104.7,73.3 v104.6,73.4 v102.3,73.4 v102.3,70.9 104.6,70.9 v104.7,71 | v104.7,71 104.7,47.28 Q3.D | Q5.D 150.5,73.1 | v150.5,73.6 150.5,73.1 | v147.9,76.3 v147.9,73.5 148,73.6 v150.5,73.6 | 150.5,73.1 150.7,73.3 v150.7,76.3 v147.9,76.3 | v147.9,76.3 150.5,73.7 v150.5,73.6
-5_VDDA_L1
  Bottom 0.5: DC1.4 51.98,25.02 52.1,24.9 C10.2 53.7,24 54.35,23.35 C9.2
-5_VDDA_L2
  Bottom 0.5: DC3.4 96.82,25.2 C35.2 99.5,24.2 100.15,23.55 C34.2
-5_VDDA_L3
  Bottom 0.5: DC5.4 142.82,25.2 C60.2 145.6,24.2 146.15,23.65 C59.2
-5_VDDB_L1
  Bottom 0.5: DC2.4 84.82,25.2 C20.2 87.9,25.1 87.9,24.2 88.55,23.55 C19.2
-5_VDDB_L2
  Bottom 0.5: DC4.4 130.82,25.2 C45.2 133.5,24.1 134.15,23.45 C44.2
-5_VDDB_L3
  Bottom 0.5: DC6.4 176.82,25.2 C70.2 179.5,24.1 180.05,23.55 C69.2
-DC  (via drill 0.5)
  Top 0.5: v71.6,33.2 71.6,31.15 C23.2 C25.1 v74.3,33.2 | v87,40.5 87,42.95 R9.2 87.05,47.04 Q1.S | Q4.S 133.09,43.06 R18.2 133.15,38.95 v133.2,38.9 | v117.4,33.6 C48.2 C50.1 119.9,31.5 120.2,31.8 v120.2,33.6 | Q6.S 179.05,47.04 R21.2 179.1,42.95 v179.1,39.2 | v163.2,33.9 163.2,32.4 163.4,32.2 C73.2 C75.1 v166,33.9
  Bottom 0.5: C24.1 C22.2 v71.6,33.2 | C19.1 90.25,23.65 90.6,24 C20.1 C21.2 89.1,27.6 88.45,28.25 C18.2 86.65,28.25 86.16,27.76 DC2.5 82.54,27.76 82.1,28.2 82.1,31.3 | C49.1 C47.2 v117.4,33.6 | C49.1 v120.2,33.6 | C44.1 135.85,23.75 136.3,24.2 C45.1 C46.2 134.8,27.8 134.35,28.25 C43.2 132.45,28.25 131.96,27.76 DC4.5 128.44,27.76 128,28.2 128,31.5 | C74.1 C72.2 v163.2,33.9 | C74.1 v166,33.9 | C69.1 181.75,23.65 182.3,24.2 C70.1 C71.2 180.8,27.6 180.25,28.15 C68.2 178.35,28.15 177.96,27.76 DC6.5 175.04,27.76 174,28.8 174,32 | C24.1 82,31.4 82.1,31.3 | 179.1,36 179.1,33.1 178,32 174,32 | 179.1,36 v179.1,39.2 | C49.1 128,31.5 | 133.2,36 133.2,33.2 132.4,32.4 128.4,32.4 128,32 128,31.5 | v133.2,38.9 133.2,36 | 133.2,36 179.1,36 | 133.2,36 87,36 | v87,40.5 87,36 | 82.1,31.3 82.1,35.4 82.7,36 87,36 | v74.3,33.2 74.3,32.6 74.5,32.4 C24.1 | C74.1 166.2,32 174,32
  Bottom 2.5: Q6.S 179.09,96.69 173.7,102.08 C80.- C81.- 127.08,102.08 | Q4.S 133.09,76.91 127,83 127,102 127.08,102.08 | B1.- 31.8,78.2 49.2,78.2 56,85 56,98 60.18,102.18 72.5,102.18 C78.- 87,102.08 | 127.08,102.08 126.98,102.18 C79.- 104.5,102.08 87,102.08 | Q1.S 87.09,101.99 87,102.08
AC1
  Top 2.5: X1.1 17.71,81.11 21.4,84.8 25.6,84.8 B1.AC1
AC2
  Top 2.5: X1.2 19.59,73.49 22.5,76.4 36.8,76.4 38.35,74.85 B1.AC2
G_BOT_L1
  Top 0.5: R8.1 80.9,38.95 80.9,37.7 79.6,36.4 79.6,26.6 75.8,22.8 73.2,22.8 73,23 72.73,23.27 U1.10
  Top 0.508: R8.1 R7.1
G_BOT_L2
  Top 0.5: R16.1 R17.1 126.85,37.45 124.2,34.8 124.2,24.1 123.1,23 119.4,23 118.6,23.8 118.6,26.27 U2.10
G_BOT_L3
  Top 0.5: R19.1 R20.1 172.45,36.85 170.1,34.5 170.1,24 169.1,23 165.1,23 164.73,23.37 U3.10
G_TOP_L1
  Top 0.5: 64.1,22.9 66,22.9 66.4,23.3 66.4,26.28
  Top 0.508: R5.1 R4.1 60.65,26.35 64.1,22.9 | 66.4,26.28 U1.15
G_TOP_L2
  Top 0.5: R11.1 R10.1 106.65,24.35 108,23 111.8,23 112.3,23.5 112.3,26.28 U2.15
G_TOP_L3
  Top 0.5: R14.1 R13.1 152.75,24.25 154,23 158,23 158.38,23.38 U3.15
GND  (via drill 0.5)
  Top 0.5: v68.9,19.3 68.9,17.02 U1.4 | v71.8,11.3 R3.1 | U2.4 114.82,19.28 v114.8,19.3 | v117.5,11.5 117.5,12.95 R24.1 | U3.4 160.92,19.28 v160.9,19.3 | v163.5,12 R27.1 | LEM1.13 32.2,16.3 31.5,17 13.8,17 13.2,16.4 LEM2.13
  Bottom 0.5: SV3.10 SV3.8 SV3.6 SV3.4 SV3.2 62.7,6.45 62.7,13.25 | 62.7,13.25 C3.1 C2.1 68.3,13.25 | 68.3,13.25 C4.1 C5.1 | 68.3,13.25 68.3,17.5 68.9,18.1 v68.9,19.3 | C5.1 72,12.3 71.8,12.1 v71.8,11.3 | 62.7,13.25 62.7,16.9 62.1,17.5 C7.2 54.7,17.5 54.25,17.05 C6.2 52.65,17.05 52.3,17.4 DC1.2 40.8,17.4 | C5.1 C1.1 75.95,13.25 80.3,17.6 DC2.2 85.8,17.6 86.15,17.25 C16.2 87.65,17.3 88.4,17.3 88.8,17.7 C17.2 96.9,17.7 97,17.6 | DC3.2 97,17.6 | 97,17.6 97.7,17.6 98.2,17.1 99.45,17.1 C31.2 100.15,17.15 100.7,17.7 C32.2 105.4,17.7 107.1,16 107.1,13.5 | C30.1 C26.1 122.25,13.45 126.4,17.6 DC4.2 132,17.6 132.5,17.1 133.45,17.1 C41.2 134.15,17.15 134.7,17.7 C42.2 138.9,17.7 139,17.6 DC5.2 143.8,17.6 144.15,17.25 C56.2 146.25,17.25 146.8,17.8 C57.2 151.9,17.8 153.1,16.6 153.1,13.7 | 113.9,13.45 C27.1 C28.1 107.15,13.45 107.1,13.5 | 113.9,13.45 C29.1 C30.1 | 113.9,13.45 113.9,17.3 114.8,18.2 v114.8,19.3 | SV4.10 SV4.8 SV4.6 SV4.4 SV4.2 108.17,4.73 107.1,5.8 107.1,13.5 | C30.1 117.7,12.6 117.5,12.4 v117.5,11.5 | C67.2 180.6,17.7 180.05,17.15 C66.2 177.85,17.15 177.4,17.6 DC6.2 172.1,17.6 168.25,13.75 C51.1 C55.1 | SV5.10 SV5.8 SV5.6 SV5.4 SV5.2 154.37,4.73 153.1,6 153.1,13.7 | 160.2,13.75 C52.1 C53.1 153.15,13.75 153.1,13.7 | 160.2,13.75 C54.1 C55.1 | 160.2,13.75 160.2,16.6 160.9,17.3 v160.9,19.3 | C55.1 163.8,12.9 163.5,12.6 v163.5,12 | 40.8,17.4 40.8,5.3 40.33,4.83 SV1.10 SV1.8 SV1.6 SV1.4 SV1.2 21.3,4.83 SV2.10 SV2.8 SV2.6 SV2.4 SV2.2 | LEM1.13 C77.2 32.52,17.4 40.8,17.4 | C76.2 13.2,17.71 LEM2.13
N$1  (via drill 0.5)
  Top 0.5: R1.2 64.7,13.9 65.11,14.31 U1.1 v65.11,19.99 v65.1,20
  Bottom 0.5: v65.1,20 65.1,16.45 64.6,15.95 C3.2
N$2  (via drill 0.5)
  Top 0.5: R2.2 66.9,13.9 66.38,14.42 U1.2 66.4,17.02 v66.4,19.2
  Bottom 0.5: C2.2 66.8,16 66.4,16.4 v66.4,19.2
N$3  (via drill 0.5)
  Top 0.5: 71.5,16.96 U1.6 | v71.5,19.3 71.5,16.96 | R3.2 71.8,15.6 71.4,16 71.4,16.86 71.5,16.96
  Bottom 0.5: v71.5,19.3 71.5,16.4 72,15.9 C5.2
N$4  (via drill 0.5)
  Top 0.5: U1.14 67.7,26.25 v67.7,24.2
  Top 0.508: U1.14 67.65,29.2 C15.2
  Bottom 0.5: C14.2 68,26.5 67.7,26.2 v67.7,24.2
N$5  (via drill 0.5)
  Top 0.5: C13.1 65.2,28.1 65.1,28 U1.16 v65.11,24.21 v65.1,24.2
  Bottom 0.5: C12.1 64.8,26.6 U1.16 v65.1,24.2
N$7
  Top 0.5: R4.2 R6.1 62.2,43.05 D1.A 52.91,43.14 Q2.G
N$8
  Top 0.5: D1.C 53.05,39 R5.2
N$9  (via drill 0.5)
  Top 0.5: v74,24.1 U1.9 74,28 74.3,28.3 C25.2
  Bottom 0.5: C24.2 74.5,26.7 74,26.2 v74,24.1
N$10  (via drill 0.5)
  Top 0.5: v71.5,24.1 71.46,24.14 U1.11 71.46,29.31 C23.1
  Bottom 0.5: C22.1 71.5,28.5 v71.5,24.1
N$12
  Top 0.5: Q1.G 75.91,43.14 D2.A 85.3,43.05 R9.1
  Top 0.508: R7.2 R9.1
N$13
  Top 0.5: D2.C 76.05,39 R8.2
N$14
  Top 0.5: Q3.G 98.91,43.14 D3.A 108.3,43.05 R12.1 R10.2
N$15
  Top 0.5: D3.C 102.4,38.95 R11.2
N$16
  Top 0.5: Q5.G 144.91,43.06 D4.A 154.4,43.05 R15.1 R13.2
N$17
  Top 0.5: R14.2 144.95,38.9 D4.C
N$18
  Top 0.5: Q4.G 121.91,43.14 D5.A 122.05,43 R18.1 R16.2
N$19
  Top 0.5: D5.C 122.05,39 R17.2
N$20
  Top 0.5: Q6.G 167.9,47.07 D6.A 177.3,43.05 | 177.3,43.05 R21.1 | R19.2 177.3,39.05 177.3,43.05
N$21
  Top 0.5: R20.2 170.7,38.95 D6.C
N$22  (via drill 0.5)
  Top 0.5: R22.2 110.4,14.5 111.01,15.11 U2.1 v111.01,19.99 v111,20
  Bottom 0.5: C28.2 110,16.2 111,17.2 v111,20
N$23  (via drill 0.5)
  Top 0.5: R23.2 112.9,14.4 112.28,15.02 U2.2 112.3,17.02 v112.3,19.3
  Bottom 0.5: C27.2 v112.3,19.3
N$24  (via drill 0.5)
  Top 0.5: R24.2 117.4,16.96 | 117.4,16.96 U2.6 | v117.4,19.3 117.4,16.96
  Bottom 0.5: C30.2 117.7,16.6 117.4,16.9 v117.4,19.3
N$25  (via drill 0.5)
  Top 0.5: v113.6,24.3 113.6,26.25 U2.14 113.55,28.5 C40.2
  Bottom 0.5: C39.2 113.5,26.9 113.6,26.8 v113.6,24.3
N$26  (via drill 0.5)
  Top 0.5: v111,24.3 U2.16 C38.1
  Bottom 0.5: C37.1 110.6,27 111,26.6 v111,24.3
N$27
  Bottom 2.5: K1.14A K1.14B 44.9,100.8 47.14,98.56 R28.1 47.14,86.74 45.15,84.75 B1.+
N$28  (via drill 0.5)
  Top 0.5: v119.9,24.3 U2.9 C50.2
  Bottom 0.5: C49.2 120.2,26.9 119.9,26.6 v119.9,24.3
N$29  (via drill 0.5)
  Top 0.5: v117.4,24.3 117.4,26.26 U2.11 117.36,28.61 C48.1
  Bottom 0.5: C47.1 v117.4,24.3
N$31  (via drill 0.5)
  Top 0.5: v157.1,19.3 U3.1 157.11,15.01 156.4,14.3 R25.2
  Bottom 0.5: C53.2 156.5,16.5 157.1,17.1 v157.1,19.3
N$32  (via drill 0.5)
  Top 0.5: v158.4,20 158.4,17.32 U3.2 158.38,15.02 159,14.4 R26.2
  Bottom 0.5: C52.2 158.8,16.6 158.4,17 v158.4,20
N$33  (via drill 0.5)
  Top 0.5: R27.2 163.5,17.26 | 163.5,17.26 U3.6 | v163.5,19.3 163.5,17.26
  Bottom 0.5: C55.2 163.8,16.5 163.5,16.8 v163.5,19.3
N$34  (via drill 0.5)
  Top 0.5: C65.2 159.65,29.4 U3.14 159.65,24.35 v159.7,24.3
  Bottom 0.5: v159.7,24.3 C64.2
N$35  (via drill 0.5)
  Top 0.5: v157.1,24.3 U3.16 C63.1
  Bottom 0.5: C62.1 156.8,27.3 157.1,27 v157.1,24.3
N$37  (via drill 0.5)
  Top 0.5: v166,24.3 U3.9 C75.2
  Bottom 0.5: C74.2 v166,24.3
N$38  (via drill 0.5)
  Top 0.5: v163.5,24.3 163.5,26.56 U3.11 163.46,29.29 C73.1
  Bottom 0.5: C72.1 163.2,27.3 163.5,27 v163.5,24.3
OUT_L1  (via drill 0.5)
  Top 0.5: C13.2 65.2,32 64.8,32.4 v64.8,33.2 64.8,38.6 64.05,39.35 R6.2 64.05,47.04 Q2.S
  Top 0.508: C13.2 C15.1 67.9,31.15 v67.9,33.3
  Top 2.5: 64.05,53 41,53 26.8,38.8 LEM1.5 LEM1.4 LEM1.3 LEM1.2 | 64.05,53 64.05,47.04 | 64.05,53 79,53 81.5,50.5 Q1.D
  Bottom 0.5: C11.2 55.2,27.3 54.65,27.85 C8.2 52.95,27.85 52.6,27.5 50.86,27.5 DC1.5 | C9.1 56.05,23.45 56.5,23.9 C10.1 56.5,26 56.8,26.3 C11.2 | C11.2 58.5,27.3 62.7,31.5 64.9,31.5 | C12.2 v64.8,33.2
  Bottom 0.508: C12.2 64.9,31.5 C14.1 67.9,31.6 v67.9,33.3
OUT_L1_LEM  (1 unrouted)
  Bottom 2.5: LEM1.9 LEM1.8 LEM1.6 39.5,38.5 31.62,46.38 X2.3
OUT_L2  (via drill 0.5)
  Top 0.5: Q3.S 110.05,47.04 R12.2 110,42.95 110,41 110.6,40.4 v110.6,33.6 110.6,31.8 111,31.4 C38.2 C40.1 v113.5,33.6
  Top 2.5: 110,58.9 35.9,58.9 17.12,40.12 12.1,40.12 7.8,35.82 LEM2.5 LEM2.4 LEM2.3 LEM2.2 | 110,58.9 110.05,58.85 110.05,47.04 | 110,58.9 125,58.9 127.5,56.4 Q4.D
  Bottom 0.5: C37.2 C39.1 v113.5,33.6 | C37.2 v110.6,33.6 | C36.2 100.6,27.6 100.05,28.15 C33.2 98.25,28.15 97.86,27.76 DC3.5 | C36.2 102,26.6 102.3,26.3 C35.1 102.3,24 101.85,23.55 C34.1 | C36.2 104.7,27.6 108.6,31.5 C37.2
OUT_L2_LEM
  Bottom 2.5: LEM2.9 LEM2.8 LEM2.7 LEM2.6 20.5,36.2 16.7,40 7.2,40 4.1,43.1 4.1,52 6.1,54 X2.2
OUT_L3  (via drill 0.5)
  Top 0.5: Q5.S 156.09,43.06 R15.2 156.15,41.05 156.8,40.4 v156.8,33.9 156.8,32.6 157.1,32.3 C63.2 | v159.7,33.9 C65.1
  Top 2.5: X2.1 15.08,61.62 15.1,61.6 19.15,65.65 155.35,65.65 | Q5.S 156.09,64.91 155.35,65.65 | 155.35,65.65 168.95,65.65 173.5,61.1 Q6.D
  Bottom 0.5: C62.2 C64.1 v159.7,33.9 | C62.2 v156.8,33.9 | DC5.5 144.06,27.76 144.35,28.05 C58.2 146.25,28.05 146.8,27.5 C61.2 | C61.2 C60.1 148.4,24.2 147.85,23.65 C59.1 | C61.2 150.5,27.5 154.8,31.8 C62.2
PRE_A1
  Top 0.5: K1.A1 19.18,104.72 16.85,107.05 D7.C 14.2,107.05 5.2,98.05 5.2,13.6 6.8,12 10.9,12 11.96,10.94 SV2.3
PRE_A2
  Top 0.5: K1.A2 17.78,112.28 16.5,111 15.35,111 D7.A 14.2,111.15 2.8,99.75 2.8,12.8 5.2,10.4 8.4,10.4 9.42,9.38 SV2.1
PWM_BOT_L1
  Top 0.5: R2.1 66.96,10.39 SV3.3
PWM_BOT_L2
  Top 0.5: R23.1 112.96,10.59 SV4.3
PWM_BOT_L3
  Top 0.5: SV5.3 159,7.31 R26.1
PWM_PIN_EN_L1  (via drill 0.5)
  Top 0.5: v70.2,20 U1.5 | U1.5 | U1.5 70.2,15.2 69.5,14.5 SV3.5
  Bottom 0.5: C4.2 69.8,15.05 69.8,16 70.2,16.4 v70.2,20
PWM_PIN_EN_L2  (via drill 0.5)
  Top 0.5: SV4.5 115.5,14.4 116.09,14.99 U2.5 v116.1,20
  Bottom 0.5: C29.2 115.5,16.2 116.1,16.8 v116.1,20
PWM_PIN_EN_L3  (via drill 0.5)
  Top 0.5: SV5.5 161.5,14.3 162.19,14.99 U3.5 162.19,19.09 162.2,19.1 v162.2,20
  Bottom 0.5: v162.2,20 162.2,17.1 161.6,16.5 C54.2
PWM_TOP_L1
  Top 0.5: R1.1 64.42,10.17 SV3.1
PWM_TOP_L2
  Top 0.5: R22.1 110.4,7.29 SV4.1
PWM_TOP_L3
  Top 0.5: R25.1 156.4,7.29 SV5.1
UOUT_LEM_L1
  Bottom 0.5: LEM1.12 34.1,12.83 35.95,10.98 SV1.7
UOUT_LEM_L2
  Bottom 0.5: LEM2.12 15.1,14.13 19.37,9.86 27.2,9.86 28.32,8.74 SV1.1
UREF_LEM_L1
  Bottom 0.5: LEM1.11 36.01,13.37 38.48,10.9 SV1.9
UREF_LEM_L2
  Bottom 0.5: LEM2.11 17.01,14.13 19.91,11.23 28.3,11.23 30.86,8.67 SV1.3